# Altium project IMX93EVK-SOM.PrjPcb (part 3 of 6)

## Sheet C-08 eMMC.SchDoc
size 513 x 386 mm; Address1: 350W 9th Ave; Address2: Suite 206; Address3: Escondido CA 92025; Address4: United States; Revision: -; ENG_APP_DATE: --/--/--; DSN_APP_DATE: --/--/--; CHK_APP_DATE: --/--/--
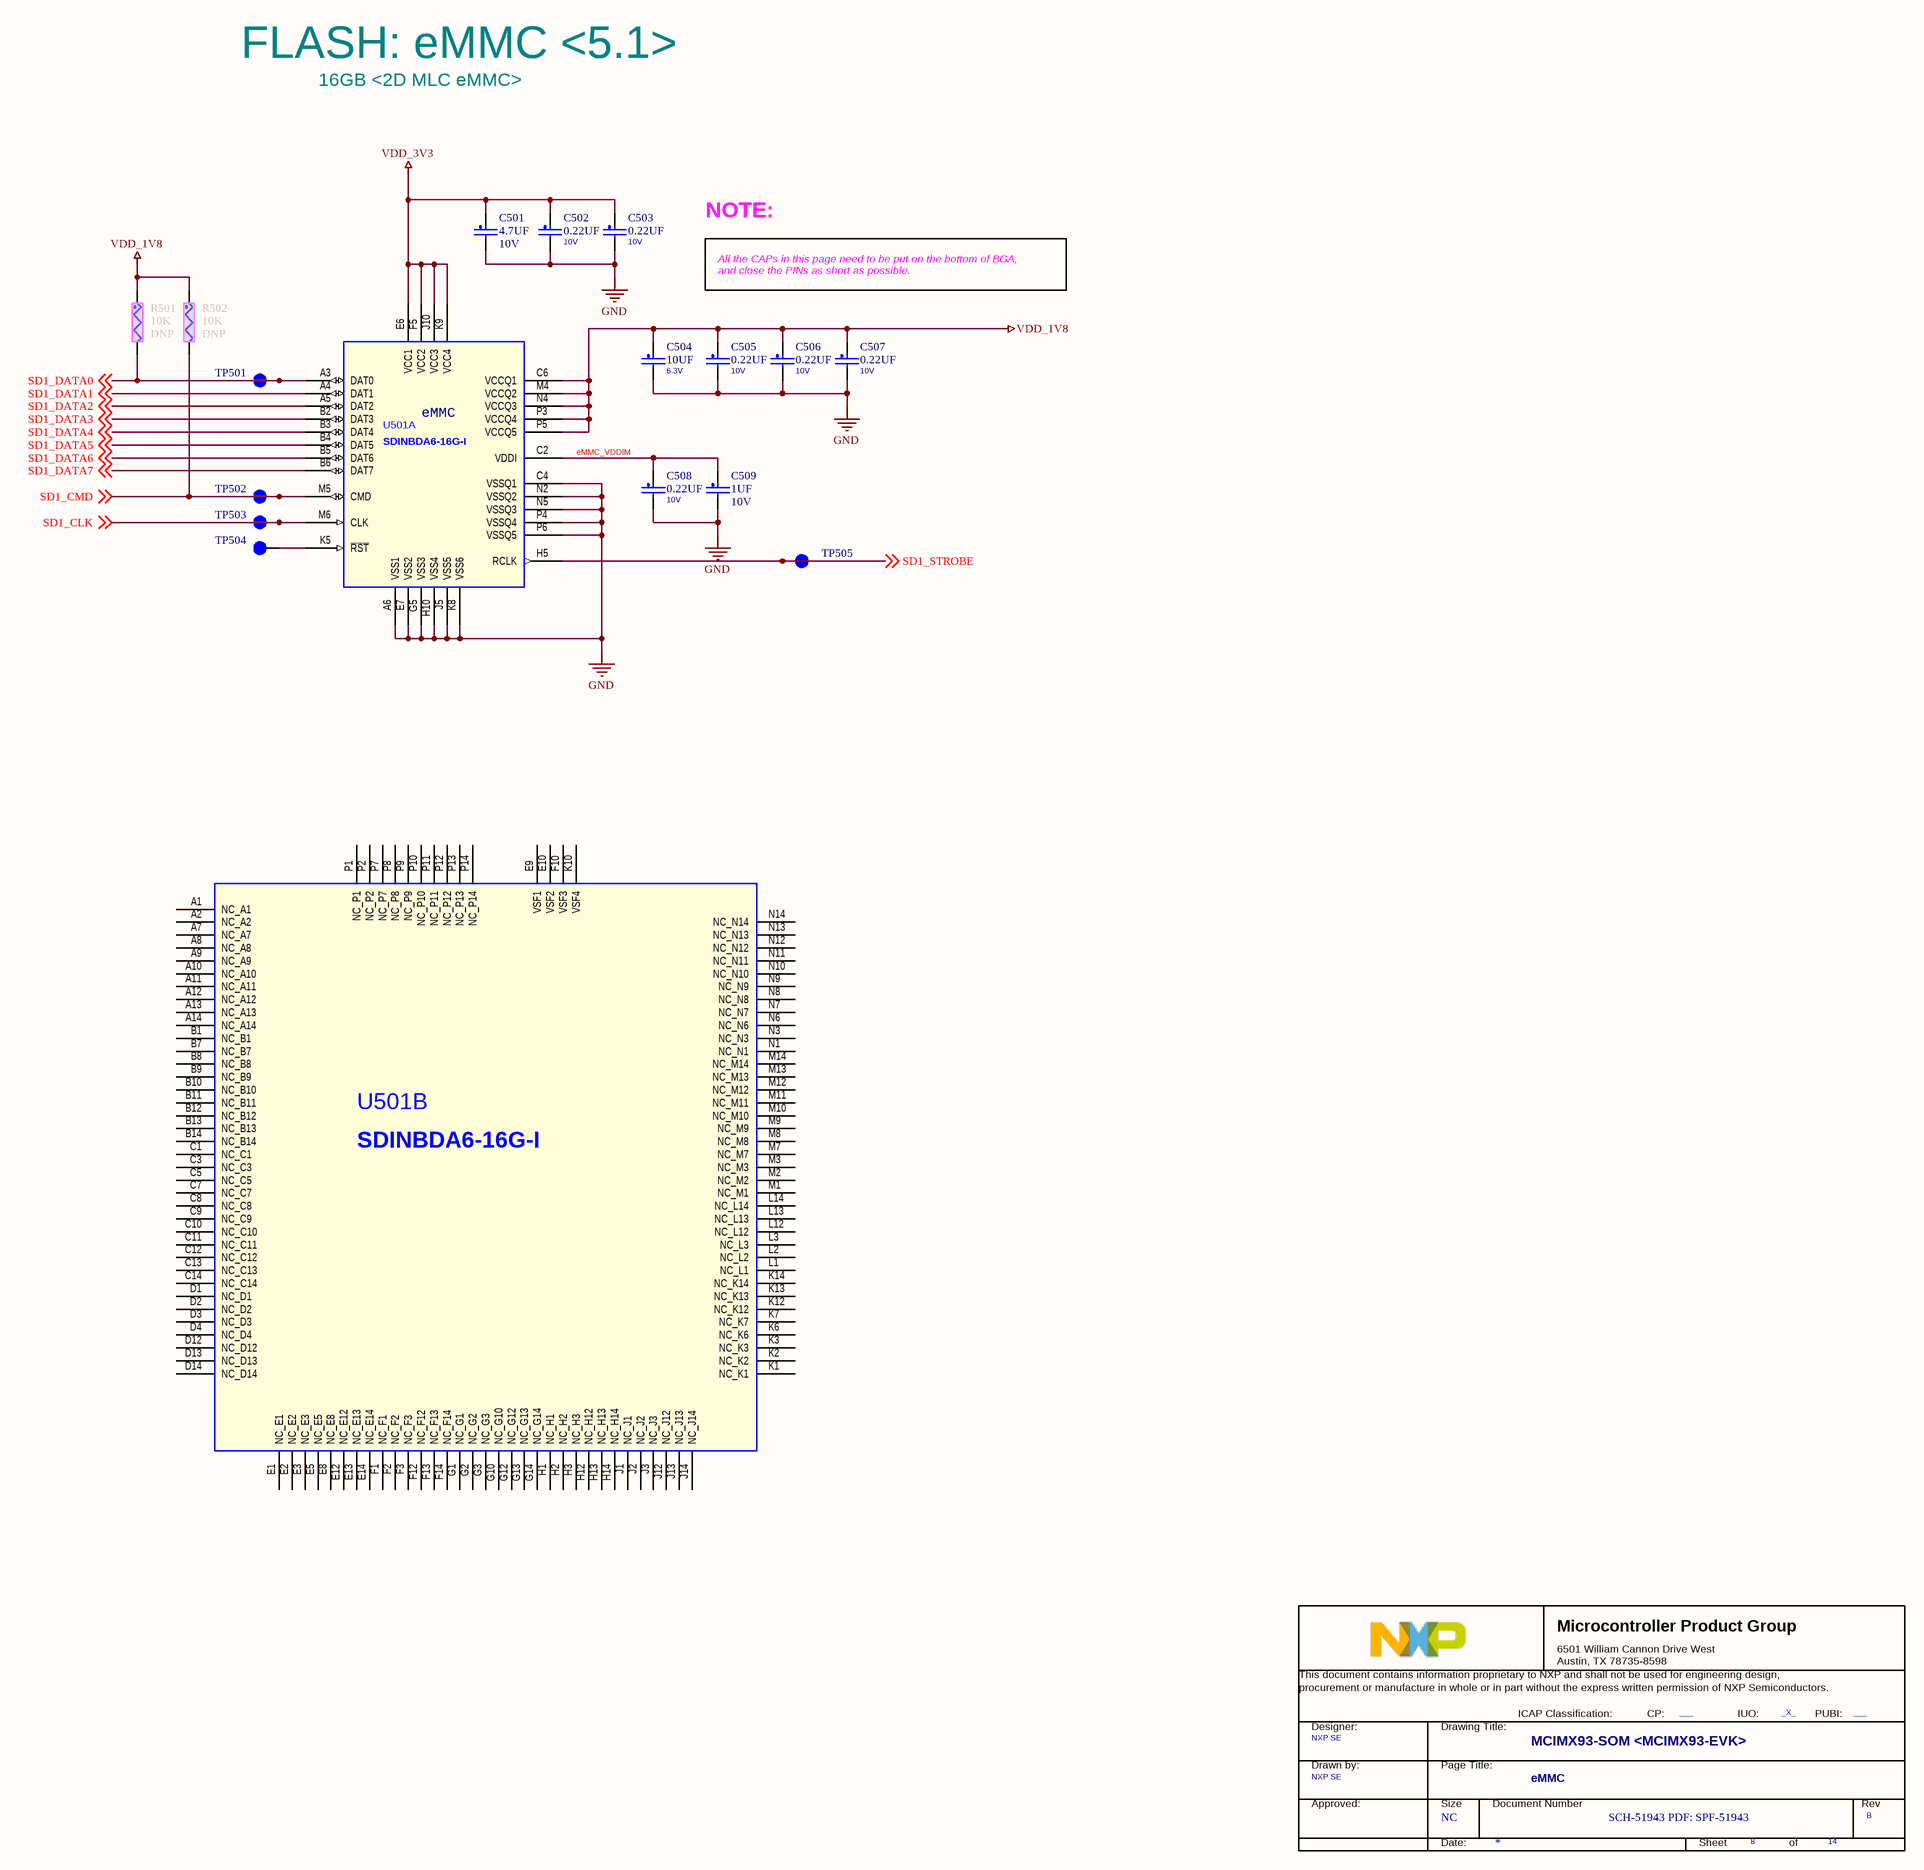
[diagram p16: C-08 eMMC.SchDoc]

### Parts
(Parts that share a designator on the sheet are numbered #1, #2 ... from top to bottom, then left to right.)
*#8  Doc: SCH-51943 PDF: SPF-51943  RevCode: B  Title: MCIMX93-SOM <MCIMX93-EVK>  Page Size: NC  Page Number: 8  Page Count: 14  PageTitle: eMMC  Designer: NXP SE  PUBI: ___  FIUO: _X_  (hidden comment: TitleBlock_MCPG)  (graphical)
C501  4.7UF  VOLTAGE: 10V  [cc0402_tol0p15]
C502  0.22UF  VOLTAGE: 10V  [0201_CC]
C503  0.22UF  VOLTAGE: 10V  [0201_CC]
C504  10UF  VOLTAGE: 6.3V  [0402_CC]
C505  0.22UF  VOLTAGE: 10V  [0201_CC]
C506  0.22UF  VOLTAGE: 10V  [0201_CC]
C507  0.22UF  VOLTAGE: 10V  [0201_CC]
C508  0.22UF  VOLTAGE: 10V  [0201_CC]
C509  1UF  VOLTAGE: 10V  [0201_CC]
R501  10K  ASSY_OPT: DNP  [0402_CC]
R502  10K  ASSY_OPT: DNP  [0402_CC]
TP501  tpad_020  [tpad_020]  (value not drawn)  (no BOM)
TP502  tpad_020  [tpad_020]  (value not drawn)  (no BOM)
TP503  tpad_020  [tpad_020]  (value not drawn)  (no BOM)
TP504  TPAD_015  [TPAD_015]  (value not drawn)  (no BOM)
TP505  tpad_020  [tpad_020]  (value not drawn)  (no BOM)
U501  SDINBDA6-16G-I  [fbga153_0p5_11p5x13]  (parts A,B of 2)

### Nets
GND: C501.2 C502.2 C503.2 C504.2 C505.2 C506.2 C507.2 C508.2 C509.2 U501.A6(VSS1) U501.C4(VSSQ1) U501.E7(VSS2) U501.G5(VSS3) U501.H10(VSS4) U501.J5(VSS5) U501.K8(VSS6) U501.N2(VSSQ2) U501.N5(VSSQ3) U501.P4(VSSQ4) U501.P6(VSSQ5)
VDD_1V8: C504.1 C505.1 C506.1 C507.1 R501.1 R502.1 U501.C6(VCCQ1) U501.M4(VCCQ2) U501.N4(VCCQ3) U501.P3(VCCQ4) U501.P5(VCCQ5)
VDD_3V3: C501.1 C502.1 C503.1 U501.E6(VCC1) U501.F5(VCC2) U501.J10(VCC3) U501.K9(VCC4)
eMMC_VDDIM: C508.1 C509.1 U501.C2(VDDI)
SD1_CLK: TP503.1(Pin1) U501.M6(CLK) ; off-sheet SD1_CLK
SD1_CMD: R502.2 TP502.1(Pin1) U501.M5(CMD) ; off-sheet SD1_CMD
SD1_DATA0: R501.2 TP501.1(Pin1) U501.A3(DAT0) ; off-sheet SD1_DATA0
SD1_DATA1: U501.A4(DAT1) ; off-sheet SD1_DATA1
SD1_DATA2: U501.A5(DAT2) ; off-sheet SD1_DATA2
SD1_DATA3: U501.B2(DAT3) ; off-sheet SD1_DATA3
SD1_DATA4: U501.B3(DAT4) ; off-sheet SD1_DATA4
SD1_DATA5: U501.B4(DAT5) ; off-sheet SD1_DATA5
SD1_DATA6: U501.B5(DAT6) ; off-sheet SD1_DATA6
SD1_DATA7: U501.B6(DAT7) ; off-sheet SD1_DATA7
SD1_STROBE: TP505.1(Pin1) U501.H5(RCLK) ; off-sheet SD1_STROBE
NetTP504_1: TP504.1(Pin1) U501.K5(~{RST})

Not connected (* = marked no-connect by the designer): U501 A1(NC_A1) A2(NC_A2) A7(NC_A7) A8(NC_A8) A9(NC_A9) A10(NC_A10) A11(NC_A11) A12(NC_A12) A13(NC_A13) A14(NC_A14) B1(NC_B1) B7(NC_B7) B8(NC_B8) B9(NC_B9) B10(NC_B10) B11(NC_B11) B12(NC_B12) B13(NC_B13) B14(NC_B14) C1(NC_C1) C3(NC_C3) C5(NC_C5) C7(NC_C7) C8(NC_C8) C9(NC_C9) C10(NC_C10) C11(NC_C11) C12(NC_C12) C13(NC_C13) C14(NC_C14) D1(NC_D1) D2(NC_D2) D3(NC_D3) D4(NC_D4) D12(NC_D12) D13(NC_D13) D14(NC_D14) E1(NC_E1) E2(NC_E2) E3(NC_E3) E5(NC_E5) E8(NC_E8) E9(VSF1) E10(VSF2) E12(NC_E12) E13(NC_E13) E14(NC_E14) F1(NC_F1) F2(NC_F2) F3(NC_F3) F10(VSF3) F12(NC_F12) F13(NC_F13) F14(NC_F14) G1(NC_G1) G2(NC_G2) G3(NC_G3) G10(NC_G10) G12(NC_G12) G13(NC_G13) G14(NC_G14) H1(NC_H1) H2(NC_H2) H3(NC_H3) H12(NC_H12) H13(NC_H13) H14(NC_H14) J1(NC_J1) J2(NC_J2) J3(NC_J3) J12(NC_J12) J13(NC_J13) J14(NC_J14) K1(NC_K1) K2(NC_K2) K3(NC_K3) K6(NC_K6) K7(NC_K7) K10(VSF4) K12(NC_K12) K13(NC_K13) K14(NC_K14) L1(NC_L1) L2(NC_L2) L3(NC_L3) L12(NC_L12) L13(NC_L13) L14(NC_L14) M1(NC_M1) M2(NC_M2) M3(NC_M3) M7(NC_M7) M8(NC_M8) M9(NC_M9) M10(NC_M10) M11(NC_M11) M12(NC_M12) M13(NC_M13) M14(NC_M14) N1(NC_N1) N3(NC_N3) N6(NC_N6) N7(NC_N7) N8(NC_N8) N9(NC_N9) N10(NC_N10) N11(NC_N11) N12(NC_N12) N13(NC_N13) N14(NC_N14) P1(NC_P1) P2(NC_P2) P7(NC_P7) P8(NC_P8) P9(NC_P9) P10(NC_P10) P11(NC_P11) P12(NC_P12) P13(NC_P13) P14(NC_P14)

### Notes on the sheet
- FLASH: eMMC <5.1>
- 16GB <2D MLC eMMC>
- NOTE:
- All the CAPs in this page need to be put on the bottom of BGA,
  and close the PINs as short as possible.
- 8
- 7
- 6
- 5
- 4
- 3
- 2
- 1
- REVISION
- DESCRIPTION
- DATE
- APPROVED
- F
- E
- D
- C
- B
- PROJECT:
- REV.
- ENG:
- APPROVALS
- PROJECT
- JordanDSP LLC <https://www.jordandsp.com>
- Envision Excellence
- SHT.
- A
- DSN:
- CHK:
- REFERENCE ITEMS
- PRJ VCS REVISION:
- TITLE
- DOC VCS REVISION:
- MODIFIED DATE:
- BOM:
- FAB DWG:
- FIRMWARE:
- ASSY DWG:
- SCALE:
- SIZE
- CAGE CODE
- FILE NAME
- DWG NO.
- PAGE
- PRODUCT REV
- OF
- (in symbol SDINBDA6_32G_I_VFBGA_153P, part A) eMMC
- (in symbol TitleBlock_MCPG) Microcontroller Product Group; 6501 William Cannon Drive West / Austin, TX 78735-8598; This document contains information proprietary to NXP and shall not be used for engineering design,; procurement or manufacture in whole or in part without the express written permission of NXP Semiconductors.; ICAP Classification:; CP:; IUO:; PUBI:; Designer:; Drawing Title:; Drawn by:; Page Title:; Approved:; Size; Document Number; Rev; Date:; Sheet; of

### Library data of the parts
*#8 = TitleBlock_MCPG: OrgName: NXP Semiconductor; OrgAddr1: NO. 192 Liangjing Rd. Pudong New Area, ShangHai; Page Create Date: March  8, 1995; DrawnBy: NXP SE; FCP: ___; Page Modify Date: *
C501 = CAP_NP: CAP CER 4.7uF 10V 10% X5R 0402; CLASS: DISCRETE; AGILE_PN: 150-80044; MFG_NAME01: SAMSUNG ELECTRO MECHANICS; MFG_PN01: CL05A475KP5NRNC; CAD_APPROVED: Yes; FPLIST: cc0402_tol0p15,cc0402_tol0p15_ov,0402_cc_nsp; 3D_Mechanical_Footprint_File: cc0402_tol0p15; PCB Footprint: cc0402_tol0p15; Tolerance: 10%; ROHS: Yes; HEIGHT: 0.65MM
C502 C507 C508 = CAP_NP: CAP CER 0.22UF 10V 20% X5R 0201; CLASS: DISCRETE; AGILE_PN: 150-78815; MFG_NAME01: Taiyo Yuden; MFG_PN01: LMK063BJ224MP-F; CAD_APPROVED: Yes; FPLIST: CC0201,CC0201_HD,0201_CC; PCB Footprint: 0201_CC; Tolerance: 20%; ROHS: Yes; HEIGHT: 0.33MM
C503 C505 C506 = CAP_NP: CAP CER 0.22UF 10V 20% X5R 0201; CLASS: DISCRETE; FPLIST: CC0201,CC0201_HD,0201_CC; CAD_APPROVED: Yes; MFG_PN01: LMK063BJ224MP-F; MFG_NAME01: Taiyo Yuden; AGILE_PN: 150-78815; PCB Footprint: 0201_CC; HEIGHT: 0.33MM; ROHS: Yes; Tolerance: 20%
C504 = CAP_NP: CAP CER 10UF 6.3V 20% X5R 0402; CLASS: DISCRETE; FPLIST: CC0402_25,CC0402_HD,0402_CC; CAD_APPROVED: Yes; MFG_PN01: CL05A106MQ5NUNC; MFG_NAME01: SAMSUNG ELECTRO MECHANICS; AGILE_PN: 150-79163; PCB Footprint: 0402_CC; HEIGHT: 0.65 MM; ROHS: Yes; Tolerance: 20%
C509 = CAP_NP: CAP CER 1.0uF 10V 10% X5R 0201; CLASS: DISCRETE; AGILE_PN: 150-81088; MFG_NAME01: SAMSUNG ELECTRO MECHANICS; MFG_PN01: CL03A105KP3NSNC; CAD_APPROVED: Yes; FPLIST: CC0201,CC0201_HD,0201_CC,cc_0201_cir; Temp Range: -55¡ãC to 85¡ãC; PCB Footprint: 0201_CC; Package Type: SMD/SMT; Package Size: 0201 (0603 Metric); Tolerance: 10%; ROHS: Yes; HEIGHT: 0.35MM
R501 = RES: RES MF 10K 1/16W 5% 0402; CLASS: DISCRETE; AGILE_PN: 470-75557; MFG_NAME01: VISHAY INTERTECHNOLOGY; MFG_PN01: CRCW040210K0JNED; CAD_APPROVED: Yes; FPLIST: RC0402_25,RC0402_HD,0402_CC; Tolerance: 5%; ROHS: Yes; HEIGHT: 0.4 MM; PCB Footprint: 0402_CC
R502 = RES: RES MF 10K 1/16W 5% 0402; CLASS: DISCRETE; FPLIST: RC0402_25,RC0402_HD,0402_CC; CAD_APPROVED: Yes; MFG_PN01: CRCW040210K0JNED; MFG_NAME01: VISHAY INTERTECHNOLOGY; AGILE_PN: 470-75557; HEIGHT: 0.4 MM; ROHS: Yes; Tolerance: 5%; PCB Footprint: 0402_CC
TP501 = TESTLOOP: TEST POINT PAD 0.5MM DIA SMT, NO PART TO ORDER; ASSY_OPT: DNP; CLASS: IO; CAD_APPROVED: Yes; AGILE_PN: 211-77484; PCB Footprint: tpad_020; HEIGHT: 0.1MM; ROHS: Yes
TP502 TP503 TP505 = TESTLOOP: TEST POINT PAD 0.5MM DIA SMT, NO PART TO ORDER; ASSY_OPT: DNP; CLASS: IO; AGILE_PN: 211-77484; CAD_APPROVED: Yes; PCB Footprint: tpad_020; ROHS: Yes; HEIGHT: 0.1MM
TP504 = TESTLOOP: TEST POINT PAD 15MIL DIA SMT, NO PART TO ORDER; ASSY_OPT: DNP; CLASS: IO; CAD_APPROVED: Yes; MFG_PN01: NOTACOMPONENT; AGILE_PN: 211-76645; PCB Footprint: TPAD_015; HEIGHT: 0.1MM; ROHS: Yes; MFG_NAME01: NOTACOMPONENT
U501 = SDINBDA6_32G_I_VFBGA_153P: IC MEM NAND FLASH 16GB MMC 5.1 CTLR 2.7-3.6V FBGA153; MFG_NAME01: SANDISK CORPORATION; Temp Range: -25¡ãC to 85¡ãC; CAD_APPROVED: Yes; AGILE_PN: 342-00870; CLASS: IC; PCB Footprint: fbga153_0p5_11p5x13; MFG_PN01: SDINBDA6-16G-I; ROHS: Yes; HEIGHT: 1MM

## Sheet C-09 BOOT_CFG.SchDoc
size 513 x 386 mm; Address1: 350W 9th Ave; Address2: Suite 206; Address3: Escondido CA 92025; Address4: United States; Revision: -; ENG_APP_DATE: --/--/--; DSN_APP_DATE: --/--/--; CHK_APP_DATE: --/--/--
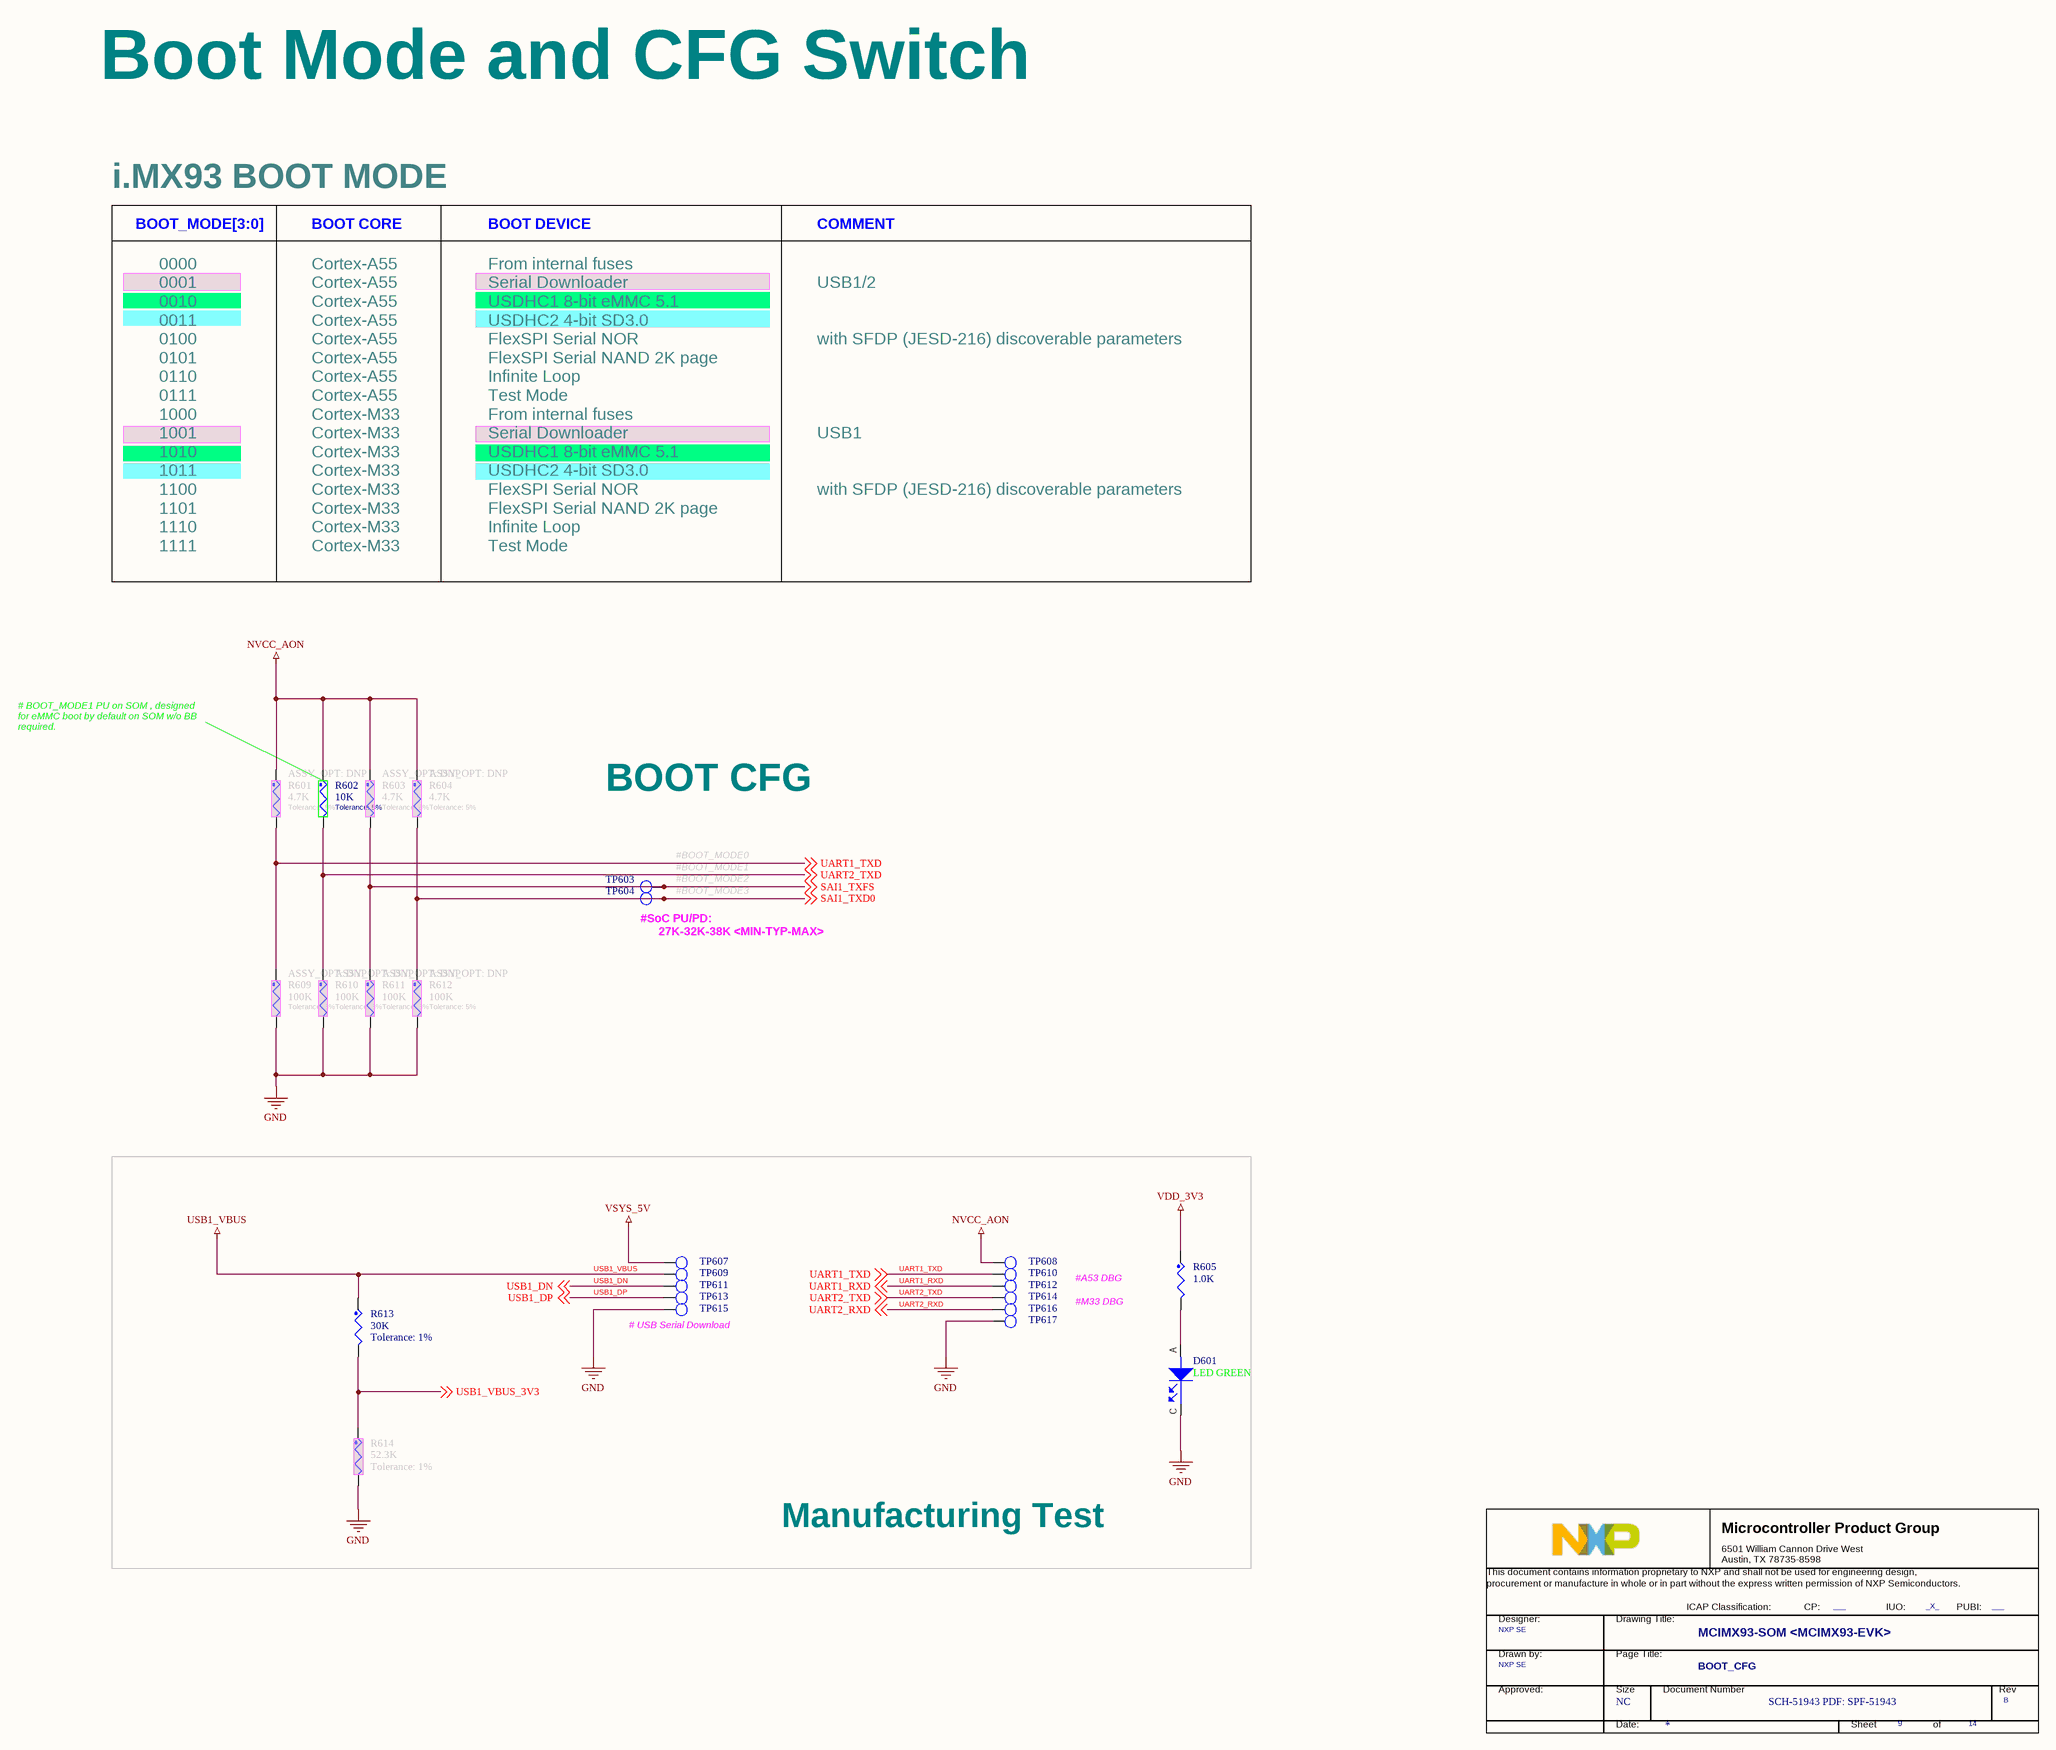
[diagram p17: C-09 BOOT_CFG.SchDoc]

### Parts
(Parts that share a designator on the sheet are numbered #1, #2 ... from top to bottom, then left to right.)
*#9  Doc: SCH-51943 PDF: SPF-51943  RevCode: B  Title: MCIMX93-SOM <MCIMX93-EVK>  Page Size: NC  Page Number: 9  Page Count: 14  PageTitle: BOOT_CFG  Designer: NXP SE  PUBI: ___  FIUO: _X_  (hidden comment: TitleBlock_MCPG)  (graphical)
D601  LED GREEN  [LED_0603]
R601  4.7K  ASSY_OPT: DNP  Tolerance: 5%  [0402_CC]
R602  10K  Tolerance: 5%  [0402_CC]
R603  4.7K  ASSY_OPT: DNP  Tolerance: 5%  [0402_CC]
R604  4.7K  ASSY_OPT: DNP  Tolerance: 5%  [0402_CC]
R605  1.0K  [0402_CC]
R609  100K  ASSY_OPT: DNP  Tolerance: 5%  [0402_CC]
R610  100K  ASSY_OPT: DNP  Tolerance: 5%  [0402_CC]
R611  100K  ASSY_OPT: DNP  Tolerance: 5%  [0402_CC]
R612  100K  ASSY_OPT: DNP  Tolerance: 5%  [0402_CC]
R613  30K  Tolerance: 1%  [0402_CC]
R614  52.3K  Tolerance: 1%  [0201_CC]
TP603  TP_35MIL  [testpoint_35mil]  (value not drawn)  (no BOM)
TP604  TP_35MIL  [testpoint_35mil]  (value not drawn)  (no BOM)
TP607  TP_35MIL  [testpoint_35mil]  (value not drawn)  (no BOM)
TP608  TP_35MIL  [testpoint_35mil]  (value not drawn)  (no BOM)
TP609  TP_35MIL  [testpoint_35mil]  (value not drawn)  (no BOM)
TP610  TP_35MIL  [testpoint_35mil]  (value not drawn)  (no BOM)
TP611  TP_35MIL  [testpoint_35mil]  (value not drawn)  (no BOM)
TP612  TP_35MIL  [testpoint_35mil]  (value not drawn)  (no BOM)
TP613  TP_35MIL  [testpoint_35mil]  (value not drawn)  (no BOM)
TP614  TP_35MIL  [testpoint_35mil]  (value not drawn)  (no BOM)
TP615  TP_35MIL  [testpoint_35mil]  (value not drawn)  (no BOM)
TP616  TP_35MIL  [testpoint_35mil]  (value not drawn)  (no BOM)
TP617  TP_35MIL  [testpoint_35mil]  (value not drawn)  (no BOM)

### Blocks framed on the sheet
Manufacturing Test: D601 R605 R613 R614 TP607-TP617

### Nets
GND: D601.C(CATHODE) R609.2 R610.2 R611.2 R612.2 R614.2 TP615.1(TP) TP617.1(TP)
NVCC_AON: R601.1 R602.1 R603.1 R604.1 TP608.1(TP)
USB1_VBUS: R613.1 TP609.1(TP)
VDD_3V3: R605.1
VSYS_5V: TP607.1(TP)
SAI1_TXD0: R604.2 R612.1 TP604.1(TP) ; off-sheet SAI1_TXD0
SAI1_TXFS: R603.2 R611.1 TP603.1(TP) ; off-sheet SAI1_TXFS
UART1_RXD: TP612.1(TP) ; off-sheet UART1_RXD
UART1_TXD: R601.2 R609.1 TP610.1(TP) ; off-sheet UART1_TXD
UART2_RXD: TP616.1(TP) ; off-sheet UART2_RXD
UART2_TXD: R602.2 R610.1 TP614.1(TP) ; off-sheet UART2_TXD
USB1_DN: TP611.1(TP) ; off-sheet USB1_DN
USB1_DP: TP613.1(TP) ; off-sheet USB1_DP
USB1_VBUS_3V3: R613.2 R614.1 ; off-sheet USB1_VBUS_3V3
NetD601_A: D601.A(ANODE) R605.2

### Notes on the sheet
- Boot Mode and CFG Switch
- i.MX93 BOOT MODE
- BOOT_MODE[3:0]
- BOOT CORE
- BOOT DEVICE
- COMMENT
- 0000
  0001
  0010
  0011
  0100
  0101
  0110
  0111
  1000
  1001
  1010
  1011
  1100
  1101
  1110
  1111
- Cortex-A55
  Cortex-A55
  Cortex-A55
  Cortex-A55
  Cortex-A55
  Cortex-A55
  Cortex-A55
  Cortex-A55
  Cortex-M33
  Cortex-M33
  Cortex-M33
  Cortex-M33
  Cortex-M33
  Cortex-M33
  Cortex-M33
  Cortex-M33
- From internal fuses
  Serial Downloader
  USDHC1 8-bit eMMC 5.1
  USDHC2 4-bit SD3.0
  FlexSPI Serial NOR
  FlexSPI Serial NAND 2K page
  Infinite Loop
  Test Mode
  From internal fuses
  Serial Downloader
  USDHC1 8-bit eMMC 5.1
  USDHC2 4-bit SD3.0
  FlexSPI Serial NOR
  FlexSPI Serial NAND 2K page
  Infinite Loop
  Test Mode
- USB1/2
  with SFDP (JESD-216) discoverable parameters
  USB1
  with SFDP (JESD-216) discoverable parameters
- # BOOT_MODE1 PU on SOM , designed
  for eMMC boot by default on SOM w/o BB
  required.
- BOOT CFG
- #BOOT_MODE0
- #BOOT_MODE1
- #BOOT_MODE2
- #BOOT_MODE3
- (near TP604) #SoC PU/PD:
  27K-32K-38K <MIN-TYP-MAX>
- #A53 DBG
- (near TP615) # USB Serial Download
- #M33 DBG
- 8
- 7
- 6
- 5
- 4
- 3
- 2
- 1
- REVISION
- DESCRIPTION
- DATE
- APPROVED
- F
- E
- D
- C
- B
- PROJECT:
- REV.
- ENG:
- APPROVALS
- PROJECT
- JordanDSP LLC <https://www.jordandsp.com>
- Envision Excellence
- SHT.
- A
- DSN:
- CHK:
- REFERENCE ITEMS
- PRJ VCS REVISION:
- TITLE
- DOC VCS REVISION:
- MODIFIED DATE:
- BOM:
- FAB DWG:
- FIRMWARE:
- ASSY DWG:
- SCALE:
- SIZE
- CAGE CODE
- FILE NAME
- DWG NO.
- PAGE
- PRODUCT REV
- OF
- (in symbol TitleBlock_MCPG) Microcontroller Product Group; 6501 William Cannon Drive West / Austin, TX 78735-8598; This document contains information proprietary to NXP and shall not be used for engineering design,; procurement or manufacture in whole or in part without the express written permission of NXP Semiconductors.; ICAP Classification:; CP:; IUO:; PUBI:; Designer:; Drawing Title:; Drawn by:; Page Title:; Approved:; Size; Document Number; Rev; Date:; Sheet; of

### Library data of the parts
*#9 = TitleBlock_MCPG: OrgAddr1: NO. 192 Liangjing Rd. Pudong New Area, ShangHai; OrgName: NXP Semiconductor; Page Create Date: March  8, 1995; DrawnBy: NXP SE; FCP: ___; Page Modify Date: *
D601 = LED: LED GRN SGL 25MA SMT 0603; CLASS: IC; CAD_APPROVED: Yes; MFG_PN01: 598-8070-107F; MFG_NAME01: DIALIGHT; AGILE_PN: 370-76672; VOLTAGE: 2V; HEIGHT: 0.8 MM; ROHS: Yes; PCB Footprint: LED_0603
R601 = RES: RES MF 4.7K 1/10W 5% AEC-Q200 0402; CLASS: DISCRETE; MFG_PN01: RK73B1ETTP472J; MFG_NAME01: KOA SPEER; CAD_APPROVED: Yes; FPLIST: RC0402_25,RC0402_HD,0402_CC,RC0402_X2; AGILE_PN: 470-82064; VOLTAGE: 50V; Temp Range: -55C to +155C; PCB Footprint: 0402_CC; ROHS: Yes; HEIGHT: 0.41mm
R602 = RES: as R501 on sheet C-08 eMMC; PCB Footprint: 0402_CC; ROHS: Yes; HEIGHT: 0.4 MM
R603 R604 = RES: RES MF 4.7K 1/10W 5% AEC-Q200 0402; CLASS: DISCRETE; Temp Range: -55C to +155C; VOLTAGE: 50V; AGILE_PN: 470-82064; FPLIST: RC0402_25,RC0402_HD,0402_CC,RC0402_X2; CAD_APPROVED: Yes; MFG_NAME01: KOA SPEER; MFG_PN01: RK73B1ETTP472J; PCB Footprint: 0402_CC; HEIGHT: 0.41mm; ROHS: Yes
R605 = RES: RES MF 1.0K 1/16W 1% 0402; CLASS: DISCRETE; MFG_PN01: RC0402FR-071KL; MFG_NAME01: YAGEO AMERICA; CAD_APPROVED: Yes; FPLIST: RC0402_25,RC0402_HD,RC0402_X2,0402_CC; AGILE_PN: 470-76037; PCB Footprint: 0402_CC; VOLTAGE: 1/16W; ROHS: Yes; Tolerance: 1%; HEIGHT: 0.4MM
R609 R612 = RES: RES MF 100K 1/16W 5% 0402; CLASS: DISCRETE; MFG_PN01: CR0402-16W-104JT; MFG_NAME01: VENKEL COMPANY; Temp Range: -55C to +155C; CAD_APPROVED: Yes; FPLIST: RC0402_25,RC0402_HD,0402_CC; AGILE_PN: 470-75597; VOLTAGE: 50V; PCB Footprint: 0402_CC; ROHS: Yes; HEIGHT: 0.40 MM
R610 R611 = RES: RES MF 100K 1/16W 5% 0402; CLASS: DISCRETE; AGILE_PN: 470-75597; FPLIST: RC0402_25,RC0402_HD,0402_CC; CAD_APPROVED: Yes; Temp Range: -55C to +155C; MFG_NAME01: VENKEL COMPANY; MFG_PN01: CR0402-16W-104JT; VOLTAGE: 50V; PCB Footprint: 0402_CC; HEIGHT: 0.40 MM; ROHS: Yes
R613 = RES: RES MF 30K 1/10W 1% AEC-Q200 0402; CLASS: DISCRETE; MFG_PN01: RK73H1ETTP3002F; MFG_NAME01: KOA SPEER; Temp Range: -55C to +155C; VOLTAGE: 50V; CAD_APPROVED: Yes; FPLIST: RC0402_25,RC0402_HD,0402_CC; AGILE_PN: 470-81708; PCB Footprint: 0402_CC; ROHS: Yes; HEIGHT: 0.40 MM
R614 = RES: RES MF 52.3K OHM 1% 1/20W 0201; CLASS: DISCRETE; MFG_PN01: RC0201FR-0752K3L; MFG_NAME01: YAGEO AMERICA; Temp Range: -55&#8451; to 125&#8451;; CAD_APPROVED: Yes; FPLIST: RC0201,0201_CC; AGILE_PN: 470-81464; ROHS: Yes; HEIGHT: 0.26MM; PCB Footprint: 0201_CC
TP603 TP607 TP614 TP616 TP617 = T POINT R: TEST POINT PAD .035 SMT, no part to order; ASSY_OPT: DNP; CLASS: IC; CAD_APPROVED: Yes; AGILE_PN: 510-75618; PCB Footprint: testpoint_35mil; HEIGHT: 0.1MM; ROHS: Yes
TP604 TP608-TP613 TP615 = T POINT R: TEST POINT PAD .035 SMT, no part to order; ASSY_OPT: DNP; CLASS: IC; AGILE_PN: 510-75618; CAD_APPROVED: Yes; PCB Footprint: testpoint_35mil; ROHS: Yes; HEIGHT: 0.1MM

## Sheet C-10 PMIC.SchDoc
size 513 x 386 mm; Address1: 350W 9th Ave; Address2: Suite 206; Address3: Escondido CA 92025; Address4: United States; Revision: -; ENG_APP_DATE: --/--/--; DSN_APP_DATE: --/--/--; CHK_APP_DATE: --/--/--
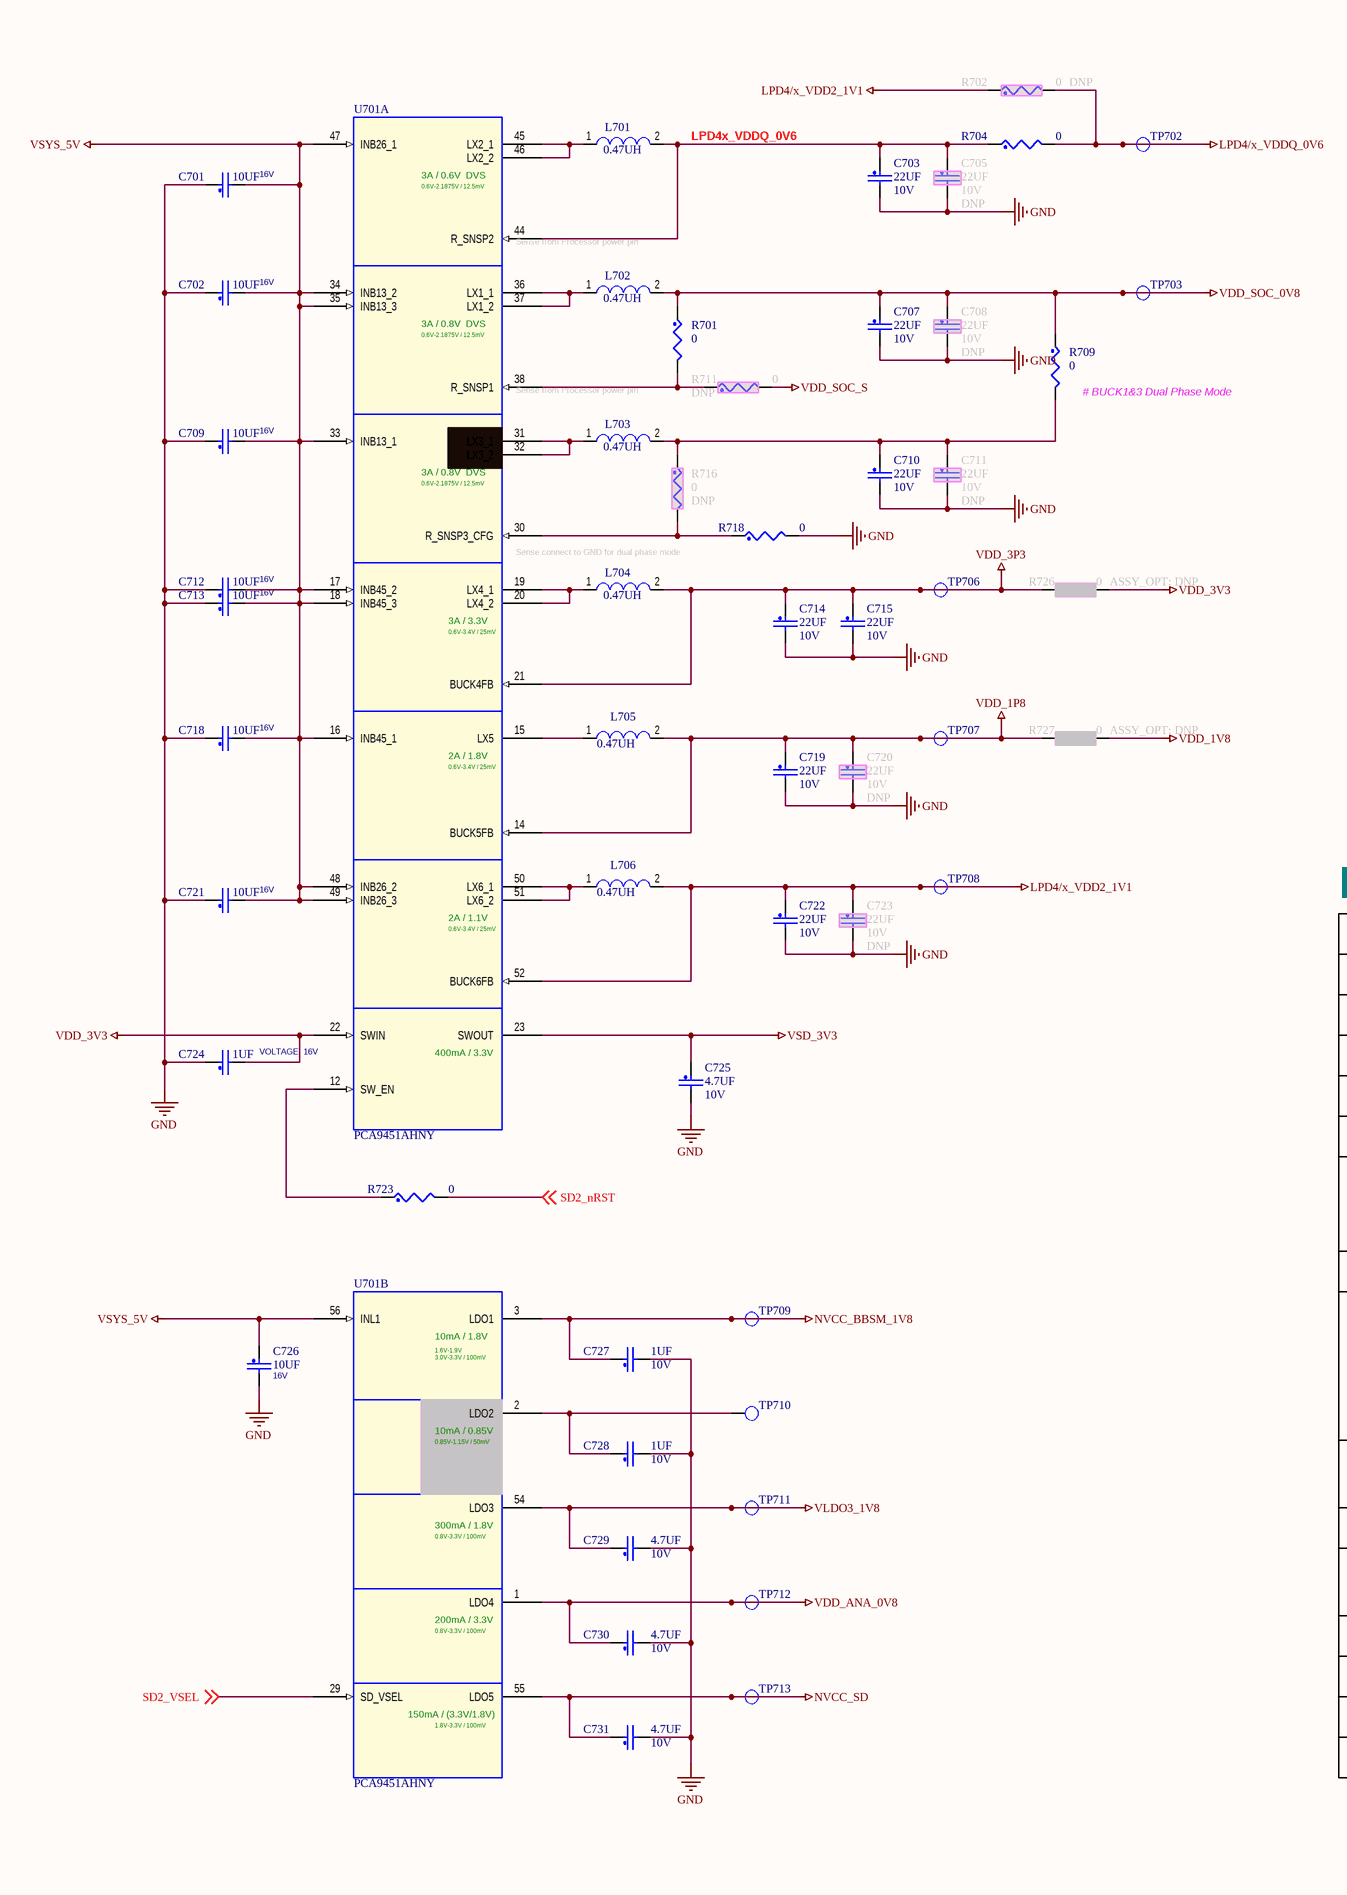
[diagram p18: C-10 PMIC.SchDoc, left]
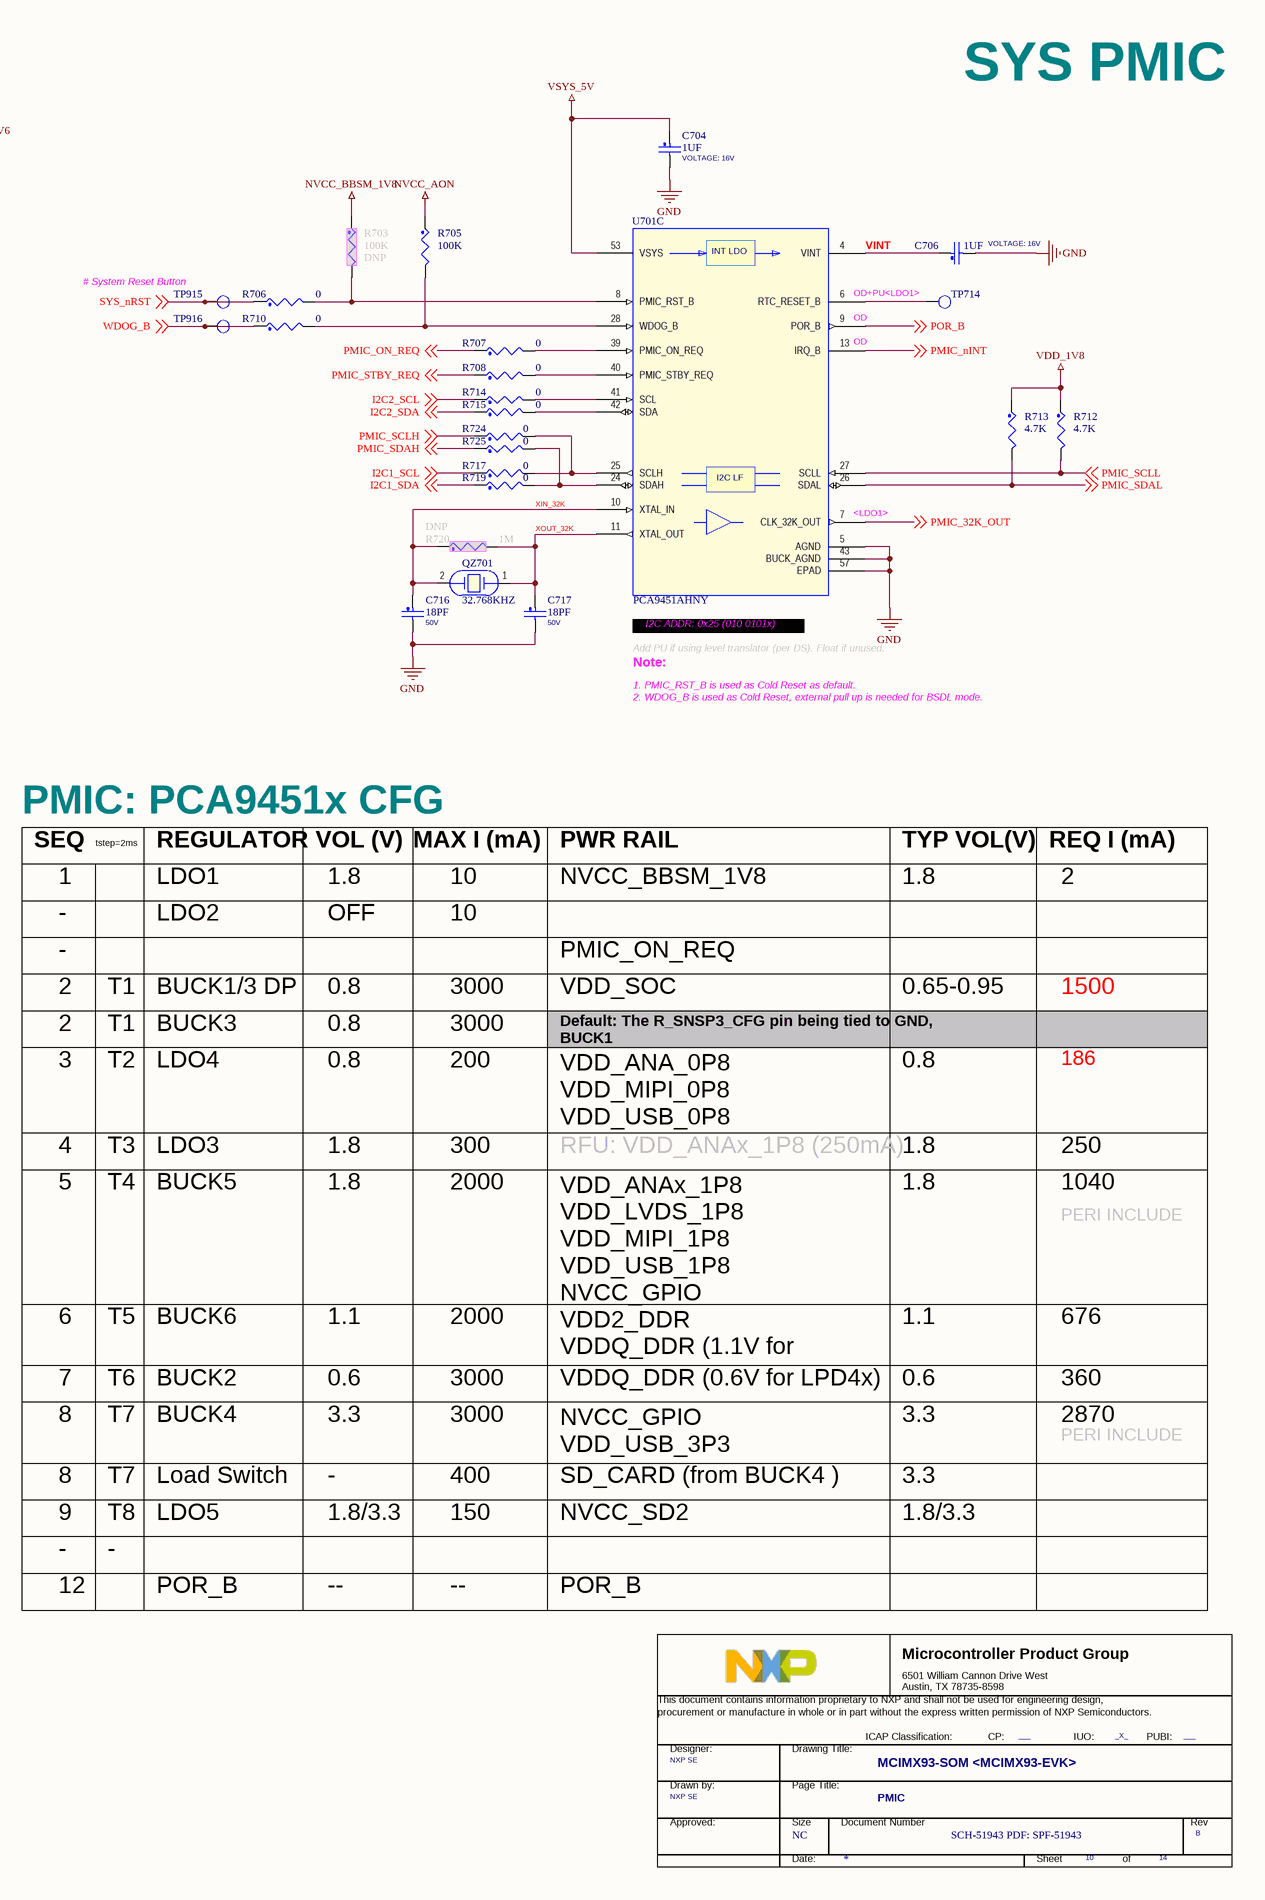
[diagram p19: C-10 PMIC.SchDoc, right]

### Parts
(Parts that share a designator on the sheet are numbered #1, #2 ... from top to bottom, then left to right.)
*#10  Doc: SCH-51943 PDF: SPF-51943  RevCode: B  Title: MCIMX93-SOM <MCIMX93-EVK>  Page Size: NC  Page Number: 10  Page Count: 14  PageTitle: PMIC  Designer: NXP SE  PUBI: ___  FIUO: _X_  (hidden comment: TitleBlock_MCPG)  (graphical)
C701  10UF  VOLTAGE: 16V  [CC0603]
C702  10UF  VOLTAGE: 16V  [CC0603]
C703  22UF  VOLTAGE: 10V  [CC0603]
C704  1UF  VOLTAGE: 16V  [0402_CC]
C705  22UF  ASSY_OPT: DNP  VOLTAGE: 10V  [CC0603]
C706  1UF  VOLTAGE: 16V  [0402_CC]
C707  22UF  VOLTAGE: 10V  [CC0603]
C708  22UF  ASSY_OPT: DNP  VOLTAGE: 10V  [CC0603]
C709  10UF  VOLTAGE: 16V  [CC0603]
C710  22UF  VOLTAGE: 10V  [CC0603]
C711  22UF  ASSY_OPT: DNP  VOLTAGE: 10V  [CC0603]
C712  10UF  VOLTAGE: 16V  [CC0603]
C713  10UF  VOLTAGE: 16V  [CC0603]
C714  22UF  VOLTAGE: 10V  [CC0603]
C715  22UF  VOLTAGE: 10V  [CC0603]
C716  18PF  VOLTAGE: 50V  [0201_CC]
C717  18PF  VOLTAGE: 50V  [0201_CC]
C718  10UF  VOLTAGE: 16V  [CC0603]
C719  22UF  VOLTAGE: 10V  [CC0603]
C720  22UF  ASSY_OPT: DNP  VOLTAGE: 10V  [CC0603]
C721  10UF  VOLTAGE: 16V  [CC0603]
C722  22UF  VOLTAGE: 10V  [CC0603]
C723  22UF  ASSY_OPT: DNP  VOLTAGE: 10V  [CC0603]
C724  1UF  VOLTAGE: 16V  [0402_CC]
C725  4.7UF  VOLTAGE: 10V  [cc0402_tol0p15]
C726  10UF  VOLTAGE: 16V  [CC0603]
C727  1UF  VOLTAGE: 10V  [0201_CC]
C728  1UF  VOLTAGE: 10V  [0201_CC]
C729  4.7UF  VOLTAGE: 10V  [cc0402_tol0p15]
C730  4.7UF  VOLTAGE: 10V  [cc0402_tol0p15]
C731  4.7UF  VOLTAGE: 10V  [cc0402_tol0p15]
L701  0.47UH  [ind_sph2520]
L702  0.47UH  [ind_sph2520]
L703  0.47UH  [ind_sph2520]
L704  0.47UH  [ind_sph2520]
L705  0.47UH  [IND_2016A]
L706  0.47UH  [IND_2016A]
QZ701  32.768KHZ  [XTAL2-3P2X1P5-SM]
R701  0  [0402_CC]
R702  0  ASSY_OPT: DNP  [0603_CC]
R703  100K  ASSY_OPT: DNP  [0402_CC]
R704  0  [0603_CC]
R705  100K  [0402_CC]
R706  0  [0402_CC]
R707  0  [0402_CC]
R708  0  [0402_CC]
R709  0  [0603_CC]
R710  0  [0402_CC]
R711  0  ASSY_OPT: DNP  [0402_CC]
R712  4.7K  [0402_CC]
R713  4.7K  [0402_CC]
R714  0  [0402_CC]
R715  0  [0402_CC]
R716  0  ASSY_OPT: DNP  [0402_CC]
R717  0  [0201_CC]
R718  0  [0402_CC]
R719  0  [0201_CC]
R720  1M  ASSY_OPT: DNP  [0201_CC]
R723  0  [0402_CC]
R724  0  [0201_CC]
R725  0  [0201_CC]
R726  0  ASSY_OPT: DNP  [RC0805_OV]
R727  0  ASSY_OPT: DNP  [RC0805_OV]
TP702  TP_35MIL  [testpoint_35mil]  (value not drawn)  (no BOM)
TP703  TP_35MIL  [testpoint_35mil]  (value not drawn)  (no BOM)
TP706  TP_35MIL  [testpoint_35mil]  (value not drawn)  (no BOM)
TP707  TP_35MIL  [testpoint_35mil]  (value not drawn)  (no BOM)
TP708  TP_35MIL  [testpoint_35mil]  (value not drawn)  (no BOM)
TP709  TP_35MIL  [testpoint_35mil]  (value not drawn)  (no BOM)
TP710  TP_35MIL  [testpoint_35mil]  (value not drawn)  (no BOM)
TP711  TP_35MIL  [testpoint_35mil]  (value not drawn)  (no BOM)
TP712  TP_35MIL  [testpoint_35mil]  (value not drawn)  (no BOM)
TP713  TP_35MIL  [testpoint_35mil]  (value not drawn)  (no BOM)
TP714  TP_35MIL  [testpoint_35mil]  (value not drawn)  (no BOM)
TP915  TP_35MIL  [testpoint_35mil]  (value not drawn)  (no BOM)
TP916  TP_35MIL  [testpoint_35mil]  (value not drawn)  (no BOM)
U701  PCA9451AHNY  [hvqfn56_0p4_7x7_ep4p7mm]  (parts A,B,C of 3)

### Nets
GND: C701.1 C702.1 C703.2 C704.2 C705.2 C706.2 C707.2 C708.2 C709.1 C710.2 C711.2 C712.1 C713.1 C714.2 C715.2 C716.2 C717.2 C718.1 C719.2 C720.2 C721.1 C722.2 C723.2 C724.1 C725.2 C726.2 C727.2 C728.2 C729.2 C730.2 C731.2 R718.2 U701.5(AGND) U701.43(BUCK_AGND) U701.57(EPAD)
LPD4/x_VDD2_1V1: C722.1 C723.1 L706.2 R702.1 TP708.1(TP) U701.52(BUCK6FB)
LPD4/x_VDDQ_0V6: R702.2 R704.2 TP702.1(TP)
NVCC_AON: R705.1
NVCC_BBSM_1V8: C727.1 R703.1 TP709.1(TP) U701.3(LDO1)
NVCC_SD: C731.1 TP713.1(TP) U701.55(LDO5)
VDD_1P8: C719.1 C720.1 L705.2 R727.1 TP707.1(TP) U701.14(BUCK5FB)
VDD_1V8: R712.1 R713.1 R727.2
VDD_3P3: C714.1 C715.1 L704.2 R726.1 TP706.1(TP) U701.21(BUCK4FB)
VDD_3V3: C724.2 R726.2 U701.22(SWIN)
VDD_ANA_0V8: C730.1 TP712.1(TP) U701.1(LDO4)
VDD_SOC_0V8: C707.1 C708.1 L702.2 R701.1 R709.1 TP703.1(TP)
VDD_SOC_S: R711.2  [project net VDD_SOC]
VLDO3_1V8: C729.1 TP711.1(TP) U701.54(LDO3)
VSD_3V3: C725.1 U701.23(SWOUT)
VSYS_5V: C701.2 C702.2 C704.1 C709.2 C712.2 C713.2 C718.2 C721.2 C726.1 U701.16(INB45_1) U701.17(INB45_2) U701.18(INB45_3) U701.33(INB13_1) U701.34(INB13_2) U701.35(INB13_3) U701.47(INB26_1) U701.48(INB26_2) U701.49(INB26_3) U701.53(VSYS) U701.56(INL1)
I2C1_SCL: R717.1 ; off-sheet I2C1_SCL
I2C1_SDA: R719.1 ; off-sheet I2C1_SDA
I2C2_SCL: R714.1 ; off-sheet I2C2_SCL
I2C2_SDA: R715.1 ; off-sheet I2C2_SDA
LPD4x_VDDQ_0V6: C703.1 C705.1 L701.2 R704.1 U701.44(R_SNSP2)
PMIC_32K_OUT: U701.7(CLK_32K_OUT) ; off-sheet PMIC_32K_OUT
PMIC_nINT: U701.13(IRQ_B) ; off-sheet PMIC_nINT
PMIC_ON_REQ: R707.1 ; off-sheet PMIC_ON_REQ
PMIC_SCLH: R724.1 ; off-sheet PMIC_SCLH
PMIC_SCLL: R712.2 U701.27(SCLL) ; off-sheet PMIC_SCLL
PMIC_SDAH: R725.1 ; off-sheet PMIC_SDAH
PMIC_SDAL: R713.2 U701.26(SDAL) ; off-sheet PMIC_SDAL
PMIC_STBY_REQ: R708.1 ; off-sheet PMIC_STBY_REQ
POR_B: U701.9(POR_B) ; off-sheet POR_B
SD2_nRST: R723.2 ; off-sheet SD2_nRST  [project net SD2_RESET_B]
SD2_VSEL: U701.29(SD_VSEL) ; off-sheet SD2_VSEL
SYS_nRST: R706.1 TP915.1(TP) ; off-sheet SYS_nRST
VINT: C706.1 U701.4(VINT)
WDOG_B: R710.1 TP916.1(TP) ; off-sheet WDOG_B
XIN_32K: C716.1 QZ701.2 R720.1 U701.10(XTAL_IN)
XOUT_32K: C717.1 QZ701.1 R720.2 U701.11(XTAL_OUT)
NetC710_1: C710.1 C711.1 L703.2 R709.2 R716.1
NetC728_1: C728.1 TP710.1(TP) U701.2(LDO2)
NetL701_1: L701.1 U701.45(LX2_1) U701.46(LX2_2)
NetL702_1: L702.1 U701.36(LX1_1) U701.37(LX1_2)
NetL703_1: L703.1 U701.31(LX3_1) U701.32(LX3_2)
NetL704_1: L704.1 U701.19(LX4_1) U701.20(LX4_2)
NetL705_1: L705.1 U701.15(LX5)
NetL706_1: L706.1 U701.50(LX6_1) U701.51(LX6_2)
NetR701_2: R701.2 R711.1 U701.38(R_SNSP1)
NetR703_2: R703.2 R706.2 U701.8(PMIC_RST_B)
NetR705_2: R705.2 R710.2 U701.28(WDOG_B)
NetR707_2: R707.2 U701.39(PMIC_ON_REQ)
NetR708_2: R708.2 U701.40(PMIC_STBY_REQ)
NetR714_2: R714.2 U701.41(SCL)
NetR715_2: R715.2 U701.42(SDA)
NetR716_2: R716.2 R718.1 U701.30(R_SNSP3_CFG)
NetR717_2: R717.2 R724.2 U701.25(SCLH)
NetR719_2: R719.2 R725.2 U701.24(SDAH)
NetR723_1: R723.1 U701.12(SW_EN)
NetTP714_1: TP714.1(TP) U701.6(RTC_RESET_B)

### Notes on the sheet
- SYS PMIC
- (near U701) 3A / 0.6V  DVS
- (near U701) 0.6V-2.1875V / 12.5mV
- (near U701) Sense from Processor power pin
- (near U701) 3A / 0.8V  DVS
- # System Reset Button
- OD+PU<LDO1>
- (near R709) # BUCK1&3 Dual Phase Mode
- (near U701) OD
- (near U701) Sense connect to GND for dual phase mode
- (near U701) <LDO1>
- (near U701) 0.6V-3.4V / 25mV
- (near U701) 3A / 3.3V
- Note:
- Add PU if using level translator (per DS). Float if unused.
- I2C ADDR: 0x25 (010 0101x)
- (near U701) 2A / 1.8V
- 1. PMIC_RST_B is used as Cold Reset as default.
- 2. WDOG_B is used as Cold Reset, external pull up is needed for BSDL mode.
- (near U701) 2A / 1.1V
- PMIC: PCA9451x CFG
- SEQ
- tstep=2ms
- REGULATOR
- VOL (V)
- MAX I (mA)
- PWR RAIL
- TYP VOL(V)
- REQ I (mA)
- -
- 1
- LDO1
- LDO2
- OFF
- 1.8
- 10
- NVCC_BBSM_1V8
- 2
- (near U701) 400mA / 3.3V
- PMIC_ON_REQ
- T1
- BUCK1/3 DP
- BUCK3
- 0.8
- 3000
- VDD_SOC
- Default: The R_SNSP3_CFG pin being tied to GND, BUCK1
  and BUCK3 are configured as dual phase mode. Curr 6A.
- 0.65-0.95
- 1500
- 3
- T2
- LDO4
- 200
- 186
- 4
- T3
- LDO3
- 300
- RFU: VDD_ANAx_1P8 (250mA)
- VDD_ANA_0P8
  VDD_MIPI_0P8
  VDD_USB_0P8
- 250
- (near U701) 1.6V-1.9V
  3.0V-3.3V / 100mV
- (near U701) 10mA / 1.8V
- 5
- T4
- BUCK5
- 2000
- 1040
- PERI INCLUDE
- (near U701) 0.85V-1.15V / 50mV
- (near U701) 10mA / 0.85V
- 6
- T5
- BUCK6
- 1.1
- VDD2_DDR
  VDDQ_DDR (1.1V for LPD4)
- VDD_ANAx_1P8
  VDD_LVDS_1P8
  VDD_MIPI_1P8
  VDD_USB_1P8
  NVCC_GPIO
- 676
- (near U701) 0.8V-3.3V / 100mV
- (near U701) 300mA / 1.8V
- 7
- T6
- BUCK2
- 0.6
- VDDQ_DDR (0.6V for LPD4x)
- 360
- (near U701) 200mA / 3.3V
- 8
- T7
- BUCK4
- 3.3
- NVCC_GPIO
  VDD_USB_3P3
- 2870
- 9
- T8
- LDO5
- Load Switch
- 1.8/3.3
- 150
- 400
- SD_CARD (from BUCK4 )
- NVCC_SD2
- (near U701) 150mA / (3.3V/1.8V)
- (near U701) 1.8V-3.3V / 100mV
- 12
- POR_B
- --
- REVISION
- DESCRIPTION
- DATE
- APPROVED
- F
- E
- D
- C
- B
- PROJECT:
- REV.
- ENG:
- APPROVALS
- PROJECT
- JordanDSP LLC <https://www.jordandsp.com>
- Envision Excellence
- SHT.
- A
- DSN:
- CHK:
- REFERENCE ITEMS
- PRJ VCS REVISION:
- TITLE
- DOC VCS REVISION:
- MODIFIED DATE:
- BOM:
- FAB DWG:
- FIRMWARE:
- ASSY DWG:
- SCALE:
- SIZE
- CAGE CODE
- FILE NAME
- DWG NO.
- PAGE
- PRODUCT REV
- OF
- (in symbol PCA9451AHNY, part C) INT LDO; I2C LF
- (in symbol TitleBlock_MCPG) Microcontroller Product Group; 6501 William Cannon Drive West / Austin, TX 78735-8598; This document contains information proprietary to NXP and shall not be used for engineering design,; procurement or manufacture in whole or in part without the express written permission of NXP Semiconductors.; ICAP Classification:; CP:; IUO:; PUBI:; Designer:; Drawing Title:; Drawn by:; Page Title:; Approved:; Size; Document Number; Rev; Date:; Sheet; of

### Library data of the parts
*#10 = TitleBlock_MCPG: as *#9 on sheet C-09 BOOT_CFG; Page Create Date: March  8, 1995; DrawnBy: NXP SE; FCP: ___; Page Modify Date: *
C701 C726 = CAP_NP: CAP CER 10.0uF 16V 10% X5R 0603; CLASS: DISCRETE; AGILE_PN: 150-80060; MFG_NAME01: MURATA; MFG_PN01: GRM188R61C106KAALD; Temp_Range: -55¡ãC to +85¡ãC; CAD_APPROVED: Yes; FPLIST: CC0603_OV,CC0603,0603_CC,cc0603_0805_nsp; PCB Footprint: CC0603; Tolerance: 10%; ROHS: Yes; HEIGHT: 0.9MM; Package Size: 0603; Package Type: SMT; Temp Range: -55¡ãC to +85¡ãC
C702 C709 C713 = CAP_NP: CAP CER 10.0uF 16V 10% X5R 0603; CLASS: DISCRETE; FPLIST: CC0603_OV,CC0603,0603_CC,cc0603_0805_nsp; CAD_APPROVED: Yes; Temp_Range: -55¡ãC to +85¡ãC; MFG_PN01: GRM188R61C106KAALD; MFG_NAME01: MURATA; AGILE_PN: 150-80060; PCB Footprint: CC0603; HEIGHT: 0.9MM; ROHS: Yes; Tolerance: 10%; Package Size: 0603; Package Type: SMT; Temp Range: -55¡ãC to +85¡ãC
C703 C710 C714 C719 C722 = CAP_NP: CAP CER 22uF 10V 20% X5R 0603; CLASS: DISCRETE; FPLIST: CC0603_OV,CC0603,0603_cc_tol; CAD_APPROVED: Yes; MFG_PN01: C1608X5R1A226M080AC; MFG_NAME01: TDK; AGILE_PN: 150-79530; WVDC: 6.3V; SIGNAL_MODEL: DEFAULT_CAPACITOR_2.2e+07pF_2_1; PCB Footprint: CC0603; HEIGHT: 1MM; ROHS: Yes; Tolerance: 20%; Package Size: 0603
C704 C724 = CAP_NP: CAP CER 1uF 16V 10% X5R 0402; CLASS: DISCRETE; AGILE_PN: 150-78973; FPLIST: CC0402_25,CC0402_HD,0402_CC,capc0402_l; CAD_APPROVED: Yes; MFG_NAME01: YAGEO; MFG_PN01: CC0402KRX5R7BB105; HEIGHT: 0.55 MM; Tolerance: 10%; ROHS: Yes; PCB Footprint: 0402_CC
C705 C711 C723 = CAP_NP: CAP CER 22uF 10V 20% X5R 0603; CLASS: DISCRETE; SIGNAL_MODEL: DEFAULT_CAPACITOR_2.2e+07pF_2_1; FPLIST: CC0603_OV,CC0603,0603_cc_tol; CAD_APPROVED: Yes; MFG_PN01: C1608X5R1A226M080AC; MFG_NAME01: TDK; AGILE_PN: 150-79530; WVDC: 6.3V; HEIGHT: 1MM; ROHS: Yes; Tolerance: 20%; Package Size: 0603; PCB Footprint: CC0603
C706 = CAP_NP: CAP CER 1uF 16V 10% X5R 0402; CLASS: DISCRETE; MFG_PN01: CC0402KRX5R7BB105; MFG_NAME01: YAGEO; CAD_APPROVED: Yes; FPLIST: CC0402_25,CC0402_HD,0402_CC,capc0402_l; AGILE_PN: 150-78973; ROHS: Yes; Tolerance: 10%; HEIGHT: 0.55 MM; PCB Footprint: 0402_CC
C707 = CAP_NP: CAP CER 22uF 10V 20% X5R 0603; CLASS: DISCRETE; SIGNAL_MODEL: DEFAULT_CAPACITOR_2.2e+07pF_2_1; WVDC: 6.3V; AGILE_PN: 150-79530; MFG_NAME01: TDK; MFG_PN01: C1608X5R1A226M080AC; CAD_APPROVED: Yes; FPLIST: CC0603_OV,CC0603,0603_cc_tol; PCB Footprint: CC0603; Tolerance: 20%; ROHS: Yes; HEIGHT: 1MM; Package Size: 0603
C708 C715 C720 = CAP_NP: CAP CER 22uF 10V 20% X5R 0603; CLASS: DISCRETE; WVDC: 6.3V; AGILE_PN: 150-79530; MFG_NAME01: TDK; MFG_PN01: C1608X5R1A226M080AC; CAD_APPROVED: Yes; FPLIST: CC0603_OV,CC0603,0603_cc_tol; SIGNAL_MODEL: DEFAULT_CAPACITOR_2.2e+07pF_2_1; Package Size: 0603; Tolerance: 20%; ROHS: Yes; HEIGHT: 1MM; PCB Footprint: CC0603
C712 C718 C721 = CAP_NP: CAP CER 10.0uF 16V 10% X5R 0603; CLASS: DISCRETE; Temp Range: -55¡ãC to +85¡ãC; AGILE_PN: 150-80060; MFG_NAME01: MURATA; MFG_PN01: GRM188R61C106KAALD; CAD_APPROVED: Yes; FPLIST: CC0603_OV,CC0603,0603_CC,cc0603_0805_nsp; PCB Footprint: CC0603; Package Type: SMT; Package Size: 0603; Tolerance: 10%; ROHS: Yes; Temp_Range: -55¡ãC to +85¡ãC; HEIGHT: 0.9MM
C716 C717 = CAP_NP: CAP CER 18pF 50V 5% C0G 0201; CLASS: DISCRETE; AGILE_PN: 150-79476; MFG_NAME01: MURATA; MFG_PN01: GRM0335C1H180JA01D; CAD_APPROVED: Yes; FPLIST: CC0201,CC0201_HD,0201_CC; Tolerance: 5%; ROHS: Yes; HEIGHT: 0.33MM; Package Size: 0201; Package Type: &#966;180mm Paper taping; PCB Footprint: 0201_CC
C725 = CAP_NP: as C501 on sheet C-08 eMMC; Tolerance: 10%; ROHS: Yes; HEIGHT: 0.65MM; PCB Footprint: cc0402_tol0p15; 3D_Mechanical_Footprint_File: cc0402_tol0p15
C727 C728 = CAP_NP: CAP CER 1.0uF 10V 10% X5R 0201; CLASS: DISCRETE; Temp Range: -55¡ãC to 85¡ãC; FPLIST: CC0201,CC0201_HD,0201_CC,cc_0201_cir; CAD_APPROVED: Yes; MFG_PN01: CL03A105KP3NSNC; MFG_NAME01: SAMSUNG ELECTRO MECHANICS; AGILE_PN: 150-81088; Package Type: SMD/SMT; Package Size: 0201 (0603 Metric); HEIGHT: 0.35MM; ROHS: Yes; Tolerance: 10%; PCB Footprint: 0201_CC
C729-C731 = CAP_NP: CAP CER 4.7uF 10V 10% X5R 0402; CLASS: DISCRETE; FPLIST: cc0402_tol0p15,cc0402_tol0p15_ov,0402_cc_nsp; CAD_APPROVED: Yes; MFG_PN01: CL05A475KP5NRNC; MFG_NAME01: SAMSUNG ELECTRO MECHANICS; AGILE_PN: 150-80044; HEIGHT: 0.65MM; ROHS: Yes; Tolerance: 10%; PCB Footprint: cc0402_tol0p15; 3D_Mechanical_Footprint_File: cc0402_tol0p15
L701 = INDUCTOR: IND PWR 0.47uH@1MHZ 4.7A 20% SMT; PART_TYPE: INDUCTOR\POWER; CLASS: DISCRETE; CAD_APPROVED: Yes; Temp_Range: -40¡ãC to +125¡ãC; MFG_PN01: WPN252012ER47MT; MFG_NAME01: SHENZHEN SUNLORD ELECTRONICS CO., LTD; AGILE_PN: 180-78647; PCB Footprint: ind_sph2520; Tolerance: 20%; HEIGHT: 1.2MM; ROHS: Yes; TOL: 20%; Temp Range: -40¡ãC to +125¡ãC
L702-L704 = INDUCTOR: IND PWR 0.47uH@1MHZ 4.7A 20% SMT; PART_TYPE: INDUCTOR\POWER; CLASS: DISCRETE; Temp Range: -40¡ãC to +125¡ãC; AGILE_PN: 180-78647; MFG_NAME01: SHENZHEN SUNLORD ELECTRONICS CO., LTD; MFG_PN01: WPN252012ER47MT; CAD_APPROVED: Yes; PCB Footprint: ind_sph2520; Tolerance: 20%; TOL: 20%; ROHS: Yes; Temp_Range: -40¡ãC to +125¡ãC; HEIGHT: 1.2MM
L705 = INDUCTOR: IND PWR 0.47uH@1MHz 3.4A 20% 2016; PART_TYPE: INDUCTOR\POWER; CLASS: DISCRETE; Temp Range: -40¡ãC to 125¡ãC; CAD_APPROVED: Yes; MFG_PN01: WPN201612HR47MT; MFG_NAME01: SHENZHEN SUNLORD ELECTRONICS CO., LTD; AGILE_PN: 180-78995; PCB Footprint: IND_2016A; Package Size: 2x1.6x1.2 mm; HEIGHT: 1.2MM; Temp_Range: -40¡ãC to 125¡ãC; ROHS: Yes; Tolerance: 20%
L706 = INDUCTOR: IND PWR 0.47uH@1MHz 3.4A 20% 2016; PART_TYPE: INDUCTOR\POWER; CLASS: DISCRETE; Temp Range: -40¡ãC to 125¡ãC; AGILE_PN: 180-78995; MFG_NAME01: SHENZHEN SUNLORD ELECTRONICS CO., LTD; MFG_PN01: WPN201612HR47MT; CAD_APPROVED: Yes; PCB Footprint: IND_2016A; Package Size: 2x1.6x1.2 mm; Tolerance: 20%; ROHS: Yes; Temp_Range: -40¡ãC to 125¡ãC; HEIGHT: 1.2MM
QZ701 = XTAL: XTAL 32.768KHZ 12.5PF 20PPM 3.2X1.5MM SMT; CLASS: IC; CAD_APPROVED: Yes; MFG_PN01: ABS07-32.768KHZ-T; MFG_NAME01: Abracon Corporation; AGILE_PN: 230-77653; HEIGHT: 0.9MM; ROHS: Yes; PCB Footprint: XTAL2-3P2X1P5-SM
R701 R706 R714 R715 = RES: RES MF ZERO OHM 1/16W 5% 0402; CLASS: DISCRETE; AGILE_PN: 470-75394; MFG_NAME01: YAGEO AMERICA; MFG_PN01: RC0402JR-070RL; CAD_APPROVED: Yes; FPLIST: RC0402_25,RC0402_HD,RC0402_X2,0402_CC; PCB Footprint: 0402_CC; VOLTAGE: 1/16W; Tolerance: 5%; ROHS: Yes; HEIGHT: 0.45 MM
R702 R709 = RES: RES MF ZERO OHM 1/10W -- 0603; CLASS: DISCRETE; AGILE_PN: 470-80866; MFG_NAME01: WALSIN TECHNOLOGY CORP.; MFG_PN01: WR06X000PTL; CAD_APPROVED: Yes; FPLIST: RC0603_OV,RC0603,R603-X2,0603_CC,IND_0603HP_NSP,CC0603_OV_NSP; Temp Range: ¨C55 ¡ãC to +155 ¡ãC; PCB Footprint: 0603_CC; ROHS: Yes; HEIGHT: 0.6MM
R703 = RES: RES MF 100K 1/16W 5% 0402; CLASS: DISCRETE; AGILE_PN: 470-75597; MFG_NAME01: VENKEL COMPANY; MFG_PN01: CR0402-16W-104JT; CAD_APPROVED: Yes; FPLIST: RC0402_25,RC0402_HD,0402_CC; VOLTAGE: 50V; Temp Range: -55C to +155C; PCB Footprint: 0402_CC; Tolerance: 5%; ROHS: Yes; HEIGHT: 0.40 MM
R704 = RES: RES MF ZERO OHM 1/10W -- 0603; CLASS: DISCRETE; Temp Range: ¨C55 ¡ãC to +155 ¡ãC; FPLIST: RC0603_OV,RC0603,R603-X2,0603_CC,IND_0603HP_NSP,CC0603_OV_NSP; CAD_APPROVED: Yes; MFG_PN01: WR06X000PTL; MFG_NAME01: WALSIN TECHNOLOGY CORP.; AGILE_PN: 470-80866; PCB Footprint: 0603_CC; HEIGHT: 0.6MM; ROHS: Yes
R705 = RES: RES MF 100K 1/16W 5% 0402; CLASS: DISCRETE; Temp Range: -55C to +155C; VOLTAGE: 50V; AGILE_PN: 470-75597; MFG_NAME01: VENKEL COMPANY; MFG_PN01: CR0402-16W-104JT; CAD_APPROVED: Yes; FPLIST: RC0402_25,RC0402_HD,0402_CC; PCB Footprint: 0402_CC; Tolerance: 5%; ROHS: Yes; HEIGHT: 0.40 MM
R707 R708 R710 R711 R716 R718 R723 = RES: RES MF ZERO OHM 1/16W 5% 0402; CLASS: DISCRETE; FPLIST: RC0402_25,RC0402_HD,RC0402_X2,0402_CC; CAD_APPROVED: Yes; MFG_PN01: RC0402JR-070RL; MFG_NAME01: YAGEO AMERICA; AGILE_PN: 470-75394; PCB Footprint: 0402_CC; HEIGHT: 0.45 MM; ROHS: Yes; Tolerance: 5%; VOLTAGE: 1/16W
R712 = RES: RES MF 4.7K 1/10W 5% AEC-Q200 0402; CLASS: DISCRETE; AGILE_PN: 470-82064; MFG_NAME01: KOA SPEER; MFG_PN01: RK73B1ETTP472J; Temp_Range: -55C to +155C; CAD_APPROVED: Yes; FPLIST: RC0402_25,RC0402_HD,0402_CC,RC0402_X2; VOLTAGE: 50V; PCB Footprint: 0402_CC; Tolerance: 5%; ROHS: Yes; HEIGHT: 0.41mm; Temp Range: -55C to +155C
R713 = RES: RES MF 4.7K 1/10W 5% AEC-Q200 0402; CLASS: DISCRETE; VOLTAGE: 50V; Temp Range: -55C to +155C; FPLIST: RC0402_25,RC0402_HD,0402_CC,RC0402_X2; CAD_APPROVED: Yes; MFG_PN01: RK73B1ETTP472J; MFG_NAME01: KOA SPEER; AGILE_PN: 470-82064; PCB Footprint: 0402_CC; HEIGHT: 0.41mm; Temp_Range: -55C to +155C; ROHS: Yes; Tolerance: 5%
R717 R719 R724 R725 = RES: RES MF ZERO OHM 1/20W -- 0201; CLASS: DISCRETE; AGILE_PN: 470-76631; MFG_NAME01: BOURNS; MFG_PN01: CR0201-J/-000GLF; CAD_APPROVED: Yes; FPLIST: RC0201,0201_CC,RC0201_X2; PCB Footprint: 0201_CC; ROHS: Yes; HEIGHT: 0.30 MM
R720 = RES: RES MF 1.0M 1/20W 5% AEC-Q200 0201; CLASS: DISCRETE; FPLIST: RC0201,0201_CC; CAD_APPROVED: Yes; Temp_Range: 55¡ãC ~ 125¡ãC; MFG_PN01: ERJ-1GNJ105C; MFG_NAME01: PANASONIC; AGILE_PN: 470-79975; VOLTAGE: 25V; PCB Footprint: 0201_CC; HEIGHT: 0.26MM; ROHS: Yes; Tolerance: 5%; Temp Range: 55¡ãC ~ 125¡ãC
R726 R727 = RES: RES MF ZERO OHM 1/8W -- 0805; CLASS: DISCRETE; MFG_PN01: RC0805JR-070RL; MFG_NAME01: YAGEO AMERICA; Temp Range: ¨C55 ¡ãC to +155 ¡ãC; CAD_APPROVED: Yes; Tolerance: 5%; FPLIST: RC0805_OV,RC0805,RC0805_OV_3P,0805_CC; AGILE_PN: 470-75442; ROHS: Yes; HEIGHT: 0.7 MM; PCB Footprint: RC0805_OV
TP702 TP703 TP706 TP708 TP709 TP711-TP714 = T POINT R: as TP603 on sheet C-09 BOOT_CFG; PCB Footprint: testpoint_35mil; HEIGHT: 0.1MM; ROHS: Yes
TP707 TP710 = T POINT R: as TP604 on sheet C-09 BOOT_CFG; PCB Footprint: testpoint_35mil; ROHS: Yes; HEIGHT: 0.1MM
TP915 TP916 = T POINT R: TEST POINT PAD .035 SMT, no part to order; CLASS: IC; AGILE_PN: 510-75618; CAD_APPROVED: Yes; PCB Footprint: testpoint_35mil; HEIGHT: 0.1MM; ROHS: Yes
U701 = PCA9451AHNY: IC POWER MANAGEMENT 2.7-5.5V HVQFN56; SWAP_INFO: (S1+S2+S3); SPLIT_INST: TRUE; AGILE_PN: TMP-CIP-8249; CAD_APPROVED: Yes; PRE_APN: 315-83273; MFG_NAME01: NXP SEMICONDUCTORS; 3D_Mechanical_Footprint_File: ftp://fcl.am.freescale.net/ALLEGRO/step/hvqfn56_0p4_7x7_ep4p7mm.step; CLASS: IC; PCB Footprint: hvqfn56_0p4_7x7_ep4p7mm; Package Size: 7x7; HEIGHT: 1MM; ROHS: Yes; MFG_PN01: PCA9451AHNY

## Sheet C-11 SOM HDR.SchDoc
size 513 x 386 mm; Address1: 350W 9th Ave; Address2: Suite 206; Address3: Escondido CA 92025; Address4: United States; Revision: -; ENG_APP_DATE: --/--/--; DSN_APP_DATE: --/--/--; CHK_APP_DATE: --/--/--
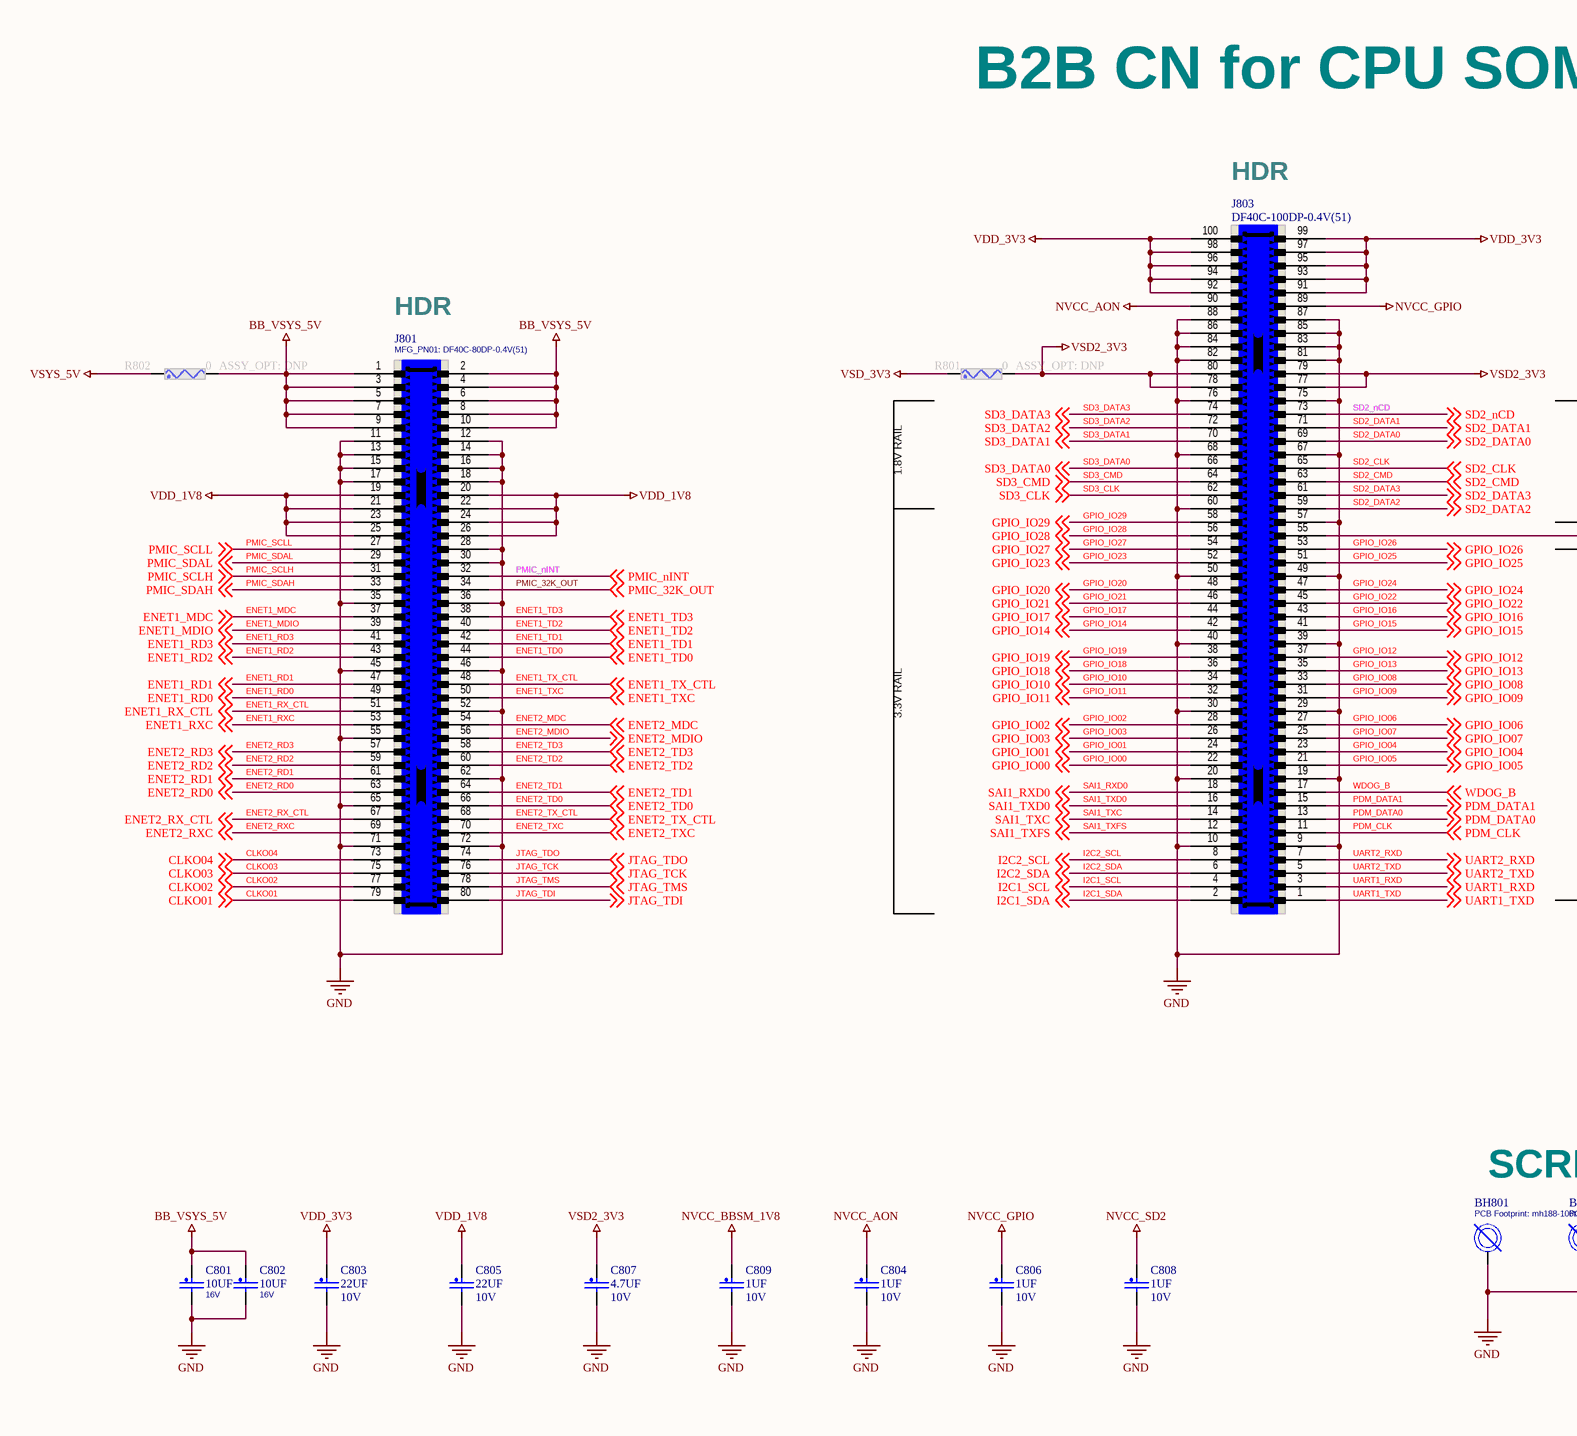
[diagram p20: C-11 SOM HDR.SchDoc, left]
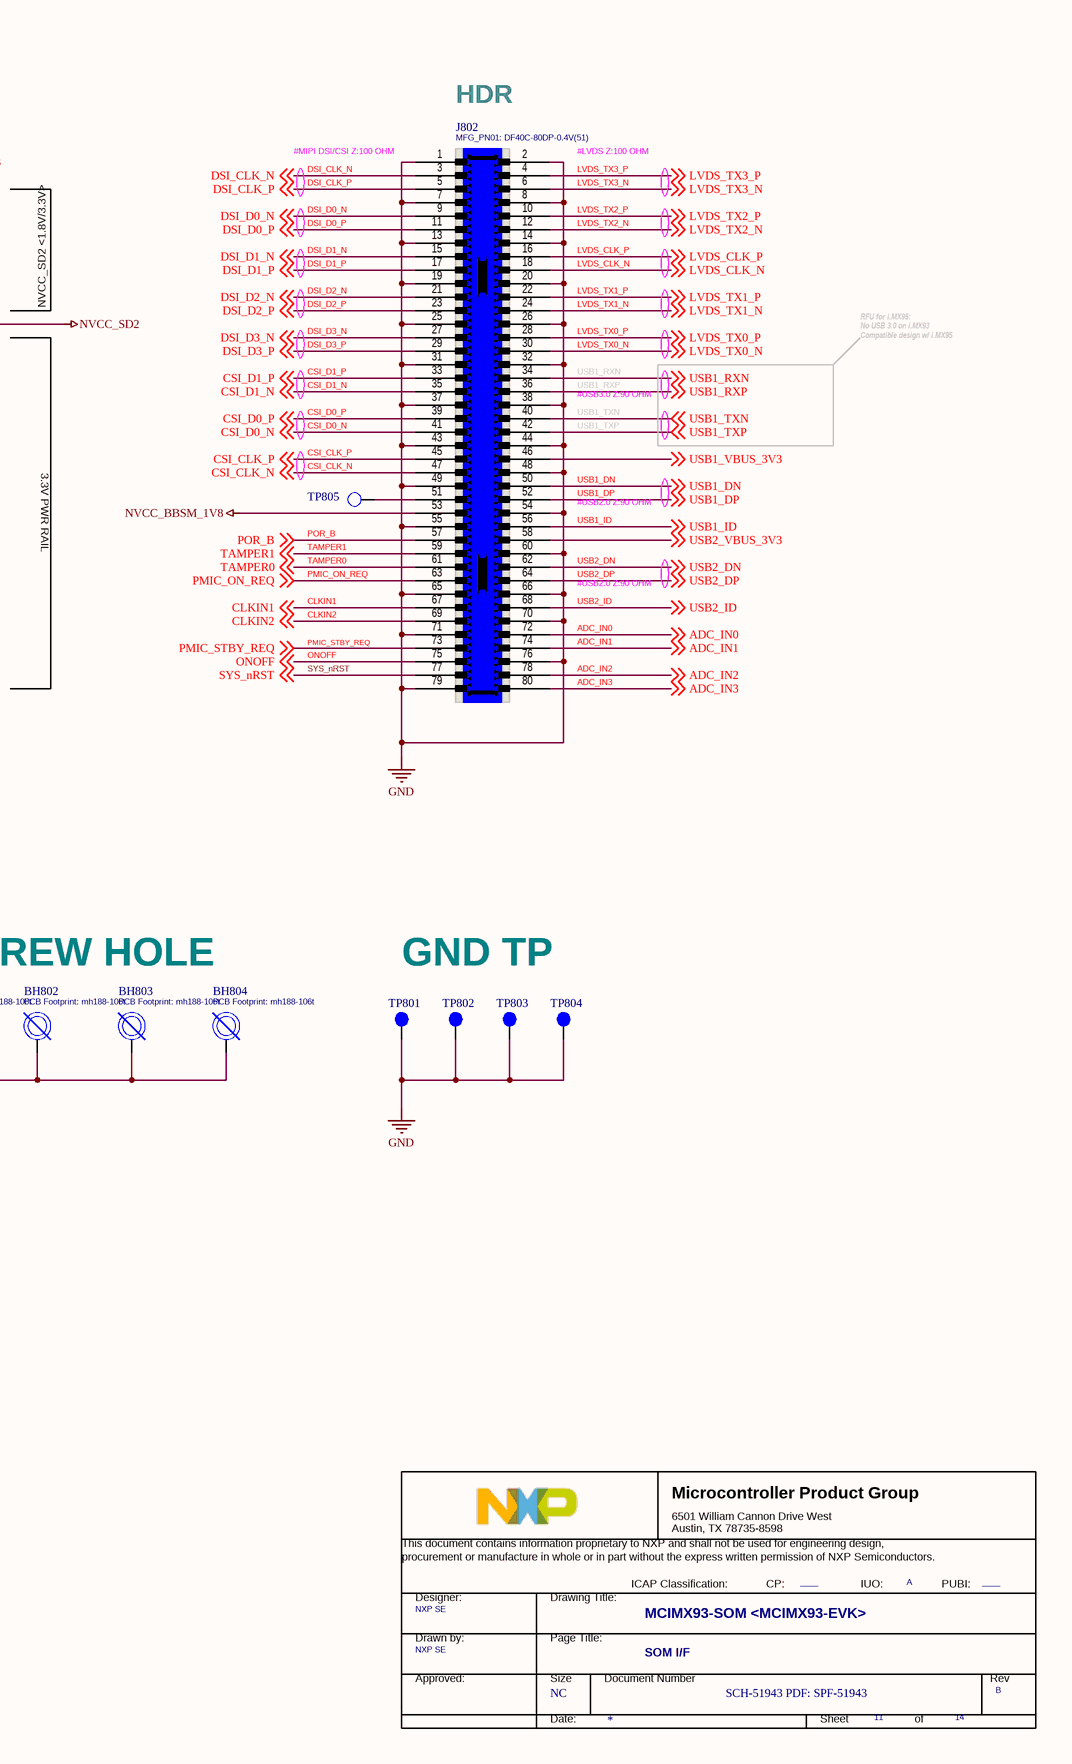
[diagram p21: C-11 SOM HDR.SchDoc, right]

### Parts
(Parts that share a designator on the sheet are numbered #1, #2 ... from top to bottom, then left to right.)
*#11  Doc: SCH-51943 PDF: SPF-51943  RevCode: B  Title: MCIMX93-SOM <MCIMX93-EVK>  Page Size: NC  Page Number: 11  Page Count: 14  PageTitle: SOM I/F  Designer: NXP SE  PUBI: ____  FIUO: A  (hidden comment: TitleBlock_MCPG)  (graphical)
BH801  FMC MOUNTING HOLE  [mh188-106t]  (value not drawn)
BH802  FMC MOUNTING HOLE  [mh188-106t]  (value not drawn)
BH803  FMC MOUNTING HOLE  [mh188-106t]  (value not drawn)
BH804  FMC MOUNTING HOLE  [mh188-106t]  (value not drawn)
C801  10UF  VOLTAGE: 16V  [CC0603]
C802  10UF  VOLTAGE: 16V  [CC0603]
C803  22UF  VOLTAGE: 10V  [CC0603]
C804  1UF  VOLTAGE: 10V  [0201_CC]
C805  22UF  VOLTAGE: 10V  [CC0603]
C806  1UF  VOLTAGE: 10V  [0201_CC]
C807  4.7UF  VOLTAGE: 10V  [cc0402_tol0p15]
C808  1UF  VOLTAGE: 10V  [0201_CC]
C809  1UF  VOLTAGE: 10V  [0201_CC]
J801  MFG_PN01: DF40C-80DP-0.4V(51)  [con80_0p4_17p7x2p05_sm]  (hidden comment: CON 2X40)
J802  MFG_PN01: DF40C-80DP-0.4V(51)  [con80_0p4_17p7x2p05_sm]  (hidden comment: CON 2X40)
J803  DF40C-100DP-0.4V(51)  [con100_0p4_21p7x2p05_sm]
R801  0  ASSY_OPT: DNP  [0603_CC]
R802  0  ASSY_OPT: DNP  [RC0805_OV]
TP801  TPAD_050  [TPAD_050]  (value not drawn)  (no BOM)
TP802  TPAD_050  [TPAD_050]  (value not drawn)  (no BOM)
TP803  TPAD_050  [TPAD_050]  (value not drawn)  (no BOM)
TP804  TPAD_050  [TPAD_050]  (value not drawn)  (no BOM)
TP805  TP_35MIL  [testpoint_35mil]  (value not drawn)  (no BOM)

### Nets
BB_VSYS_5V: C801.1 C802.1 J801.1(A1) J801.2(B1) J801.3(A2) J801.4(B2) J801.5(A3) J801.6(B3) J801.7(A4) J801.8(B4) J801.9(A5) J801.10(B5) R802.2
GND: BH801.1 BH802.1 BH803.1 BH804.1 C801.2 C802.2 C803.2 C804.2 C805.2 C806.2 C807.2 C808.2 C809.2 J801.11(A6) J801.12(B6) J801.13(A7) J801.14(B7) J801.15(A8) J801.16(B8) J801.17(A9) J801.18(B9) J801.28(B14) J801.30(B15) J801.35(A18) J801.36(B18) J801.45(A23) J801.46(B23) J801.52(B26) J801.55(A28) J801.62(B31) J801.65(A33) J801.71(A36) J801.72(B36) J802.1(A1) J802.2(B1) J802.7(A4) J802.8(B4) J802.13(A7) J802.14(B7) J802.19(A10) J802.20(B10) J802.25(A13) J802.26(B13) J802.31(A16) J802.32(B16) J802.37(A19) J802.38(B19) J802.43(A22) J802.44(B22) J802.48(B24) J802.49(A25) J802.54(B27) J802.55(A28) J802.60(B30) J802.65(A33) J802.66(B33) J802.70(B35) J802.71(A36) J802.76(B38) J802.79(A40) J803.9 J803.10 J803.19 J803.20 J803.29 J803.30 J803.39 J803.40 J803.49 J803.50 J803.57 J803.60 J803.67 J803.68 J803.75 J803.76 J803.81 J803.82 J803.83 J803.84 J803.85 J803.86 J803.87 J803.88 TP801.1(Pin1) TP802.1(Pin1) TP803.1(Pin1) TP804.1(Pin1)
NVCC_AON: C804.1 J803.90
NVCC_BBSM_1V8: C809.1 J802.53(A27)
NVCC_GPIO: C806.1 J803.89
NVCC_SD2: C808.1 J803.55
VDD_1V8: C805.1 J801.19(A10) J801.20(B10) J801.21(A11) J801.22(B11) J801.23(A12) J801.24(B12) J801.25(A13) J801.26(B13)
VDD_3V3: C803.1 J803.91 J803.92 J803.93 J803.94 J803.95 J803.96 J803.97 J803.98 J803.99 J803.100
VSD2_3V3: C807.1 J803.77 J803.78 J803.79 J803.80 R801.2
VSD_3V3: R801.1
VSYS_5V: R802.1
ADC_IN0: J802.72(B36) ; off-sheet ADC_IN0
ADC_IN1: J802.74(B37) ; off-sheet ADC_IN1
ADC_IN2: J802.78(B39) ; off-sheet ADC_IN2
ADC_IN3: J802.80(B40) ; off-sheet ADC_IN3
CLKIN1: J802.67(A34) ; off-sheet CLKIN1
CLKIN2: J802.69(A35) ; off-sheet CLKIN2
CLKO01: J801.79(A40) ; off-sheet CLKO01
CLKO02: J801.77(A39) ; off-sheet CLKO02
CLKO03: J801.75(A38) ; off-sheet CLKO03
CLKO04: J801.73(A37) ; off-sheet CLKO04
CSI_CLK_N: J802.47(A24) ; off-sheet CSI_CLK_N
CSI_CLK_P: J802.45(A23) ; off-sheet CSI_CLK_P
CSI_D0_N: J802.41(A21) ; off-sheet CSI_D0_N
CSI_D0_P: J802.39(A20) ; off-sheet CSI_D0_P
CSI_D1_N: J802.35(A18) ; off-sheet CSI_D1_N
CSI_D1_P: J802.33(A17) ; off-sheet CSI_D1_P
DSI_CLK_N: J802.3(A2) ; off-sheet DSI_CLK_N
DSI_CLK_P: J802.5(A3) ; off-sheet DSI_CLK_P
DSI_D0_N: J802.9(A5) ; off-sheet DSI_D0_N
DSI_D0_P: J802.11(A6) ; off-sheet DSI_D0_P
DSI_D1_N: J802.15(A8) ; off-sheet DSI_D1_N
DSI_D1_P: J802.17(A9) ; off-sheet DSI_D1_P
DSI_D2_N: J802.21(A11) ; off-sheet DSI_D2_N
DSI_D2_P: J802.23(A12) ; off-sheet DSI_D2_P
DSI_D3_N: J802.27(A14) ; off-sheet DSI_D3_N
DSI_D3_P: J802.29(A15) ; off-sheet DSI_D3_P
ENET1_MDC: J801.37(A19) ; off-sheet ENET1_MDC
ENET1_MDIO: J801.39(A20) ; off-sheet ENET1_MDIO
ENET1_RD0: J801.49(A25) ; off-sheet ENET1_RD0
ENET1_RD1: J801.47(A24) ; off-sheet ENET1_RD1
ENET1_RD2: J801.43(A22) ; off-sheet ENET1_RD2
ENET1_RD3: J801.41(A21) ; off-sheet ENET1_RD3
ENET1_RX_CTL: J801.51(A26) ; off-sheet ENET1_RX_CTL
ENET1_RXC: J801.53(A27) ; off-sheet ENET1_RXC
ENET1_TD0: J801.44(B22) ; off-sheet ENET1_TD0
ENET1_TD1: J801.42(B21) ; off-sheet ENET1_TD1
ENET1_TD2: J801.40(B20) ; off-sheet ENET1_TD2
ENET1_TD3: J801.38(B19) ; off-sheet ENET1_TD3
ENET1_TX_CTL: J801.48(B24) ; off-sheet ENET1_TX_CTL
ENET1_TXC: J801.50(B25) ; off-sheet ENET1_TXC
ENET2_MDC: J801.54(B27) ; off-sheet ENET2_MDC
ENET2_MDIO: J801.56(B28) ; off-sheet ENET2_MDIO
ENET2_RD0: J801.63(A32) ; off-sheet ENET2_RD0
ENET2_RD1: J801.61(A31) ; off-sheet ENET2_RD1
ENET2_RD2: J801.59(A30) ; off-sheet ENET2_RD2
ENET2_RD3: J801.57(A29) ; off-sheet ENET2_RD3
ENET2_RX_CTL: J801.67(A34) ; off-sheet ENET2_RX_CTL
ENET2_RXC: J801.69(A35) ; off-sheet ENET2_RXC
ENET2_TD0: J801.66(B33) ; off-sheet ENET2_TD0
ENET2_TD1: J801.64(B32) ; off-sheet ENET2_TD1
ENET2_TD2: J801.60(B30) ; off-sheet ENET2_TD2
ENET2_TD3: J801.58(B29) ; off-sheet ENET2_TD3
ENET2_TX_CTL: J801.68(B34) ; off-sheet ENET2_TX_CTL
ENET2_TXC: J801.70(B35) ; off-sheet ENET2_TXC
GPIO_IO00: J803.22 ; off-sheet GPIO_IO00
GPIO_IO01: J803.24 ; off-sheet GPIO_IO01
GPIO_IO02: J803.28 ; off-sheet GPIO_IO02
GPIO_IO03: J803.26 ; off-sheet GPIO_IO03
GPIO_IO04: J803.23 ; off-sheet GPIO_IO04
GPIO_IO05: J803.21 ; off-sheet GPIO_IO05
GPIO_IO06: J803.27 ; off-sheet GPIO_IO06
GPIO_IO07: J803.25 ; off-sheet GPIO_IO07
GPIO_IO08: J803.33 ; off-sheet GPIO_IO08
GPIO_IO09: J803.31 ; off-sheet GPIO_IO09
GPIO_IO10: J803.34 ; off-sheet GPIO_IO10
GPIO_IO11: J803.32 ; off-sheet GPIO_IO11
GPIO_IO12: J803.37 ; off-sheet GPIO_IO12
GPIO_IO13: J803.35 ; off-sheet GPIO_IO13
GPIO_IO14: J803.42 ; off-sheet GPIO_IO14
GPIO_IO15: J803.41 ; off-sheet GPIO_IO15
GPIO_IO16: J803.43 ; off-sheet GPIO_IO16
GPIO_IO17: J803.44 ; off-sheet GPIO_IO17
GPIO_IO18: J803.36 ; off-sheet GPIO_IO18
GPIO_IO19: J803.38 ; off-sheet GPIO_IO19
GPIO_IO20: J803.48 ; off-sheet GPIO_IO20
GPIO_IO21: J803.46 ; off-sheet GPIO_IO21
GPIO_IO22: J803.45 ; off-sheet GPIO_IO22
GPIO_IO23: J803.52 ; off-sheet GPIO_IO23
GPIO_IO24: J803.47 ; off-sheet GPIO_IO24
GPIO_IO25: J803.51 ; off-sheet GPIO_IO25
GPIO_IO26: J803.53 ; off-sheet GPIO_IO26
GPIO_IO27: J803.54 ; off-sheet GPIO_IO27
GPIO_IO28: J803.56 ; off-sheet GPIO_IO28
GPIO_IO29: J803.58 ; off-sheet GPIO_IO29
I2C1_SCL: J803.4 ; off-sheet I2C1_SCL
I2C1_SDA: J803.2 ; off-sheet I2C1_SDA
I2C2_SCL: J803.8 ; off-sheet I2C2_SCL
I2C2_SDA: J803.6 ; off-sheet I2C2_SDA
JTAG_TCK: J801.76(B38) ; off-sheet JTAG_TCK
JTAG_TDI: J801.80(B40) ; off-sheet JTAG_TDI
JTAG_TDO: J801.74(B37) ; off-sheet JTAG_TDO
JTAG_TMS: J801.78(B39) ; off-sheet JTAG_TMS
LVDS_CLK_N: J802.18(B9) ; off-sheet LVDS_CLK_N
LVDS_CLK_P: J802.16(B8) ; off-sheet LVDS_CLK_P
LVDS_TX0_N: J802.30(B15) ; off-sheet LVDS_TX0_N
LVDS_TX0_P: J802.28(B14) ; off-sheet LVDS_TX0_P
LVDS_TX1_N: J802.24(B12) ; off-sheet LVDS_TX1_N
LVDS_TX1_P: J802.22(B11) ; off-sheet LVDS_TX1_P
LVDS_TX2_N: J802.12(B6) ; off-sheet LVDS_TX2_N
LVDS_TX2_P: J802.10(B5) ; off-sheet LVDS_TX2_P
LVDS_TX3_N: J802.6(B3) ; off-sheet LVDS_TX3_N
LVDS_TX3_P: J802.4(B2) ; off-sheet LVDS_TX3_P
ONOFF: J802.75(A38) ; off-sheet ONOFF
PDM_CLK: J803.11 ; off-sheet PDM_CLK
PDM_DATA0: J803.13 ; off-sheet PDM_DATA0
PDM_DATA1: J803.15 ; off-sheet PDM_DATA1
PMIC_32K_OUT: J801.34(B17) ; off-sheet PMIC_32K_OUT
PMIC_nINT: J801.32(B16) ; off-sheet PMIC_nINT
PMIC_ON_REQ: J802.63(A32) ; off-sheet PMIC_ON_REQ
PMIC_SCLH: J801.31(A16) ; off-sheet PMIC_SCLH
PMIC_SCLL: J801.27(A14) ; off-sheet PMIC_SCLL
PMIC_SDAH: J801.33(A17) ; off-sheet PMIC_SDAH
PMIC_SDAL: J801.29(A15) ; off-sheet PMIC_SDAL
PMIC_STBY_REQ: J802.73(A37) ; off-sheet PMIC_STBY_REQ
POR_B: J802.57(A29) ; off-sheet POR_B
SAI1_RXD0: J803.18 ; off-sheet SAI1_RXD0
SAI1_TXC: J803.14 ; off-sheet SAI1_TXC
SAI1_TXD0: J803.16 ; off-sheet SAI1_TXD0
SAI1_TXFS: J803.12 ; off-sheet SAI1_TXFS
SD2_CLK: J803.65 ; off-sheet SD2_CLK
SD2_CMD: J803.63 ; off-sheet SD2_CMD
SD2_DATA0: J803.69 ; off-sheet SD2_DATA0
SD2_DATA1: J803.71 ; off-sheet SD2_DATA1
SD2_DATA2: J803.59 ; off-sheet SD2_DATA2
SD2_DATA3: J803.61 ; off-sheet SD2_DATA3
SD2_nCD: J803.73 ; off-sheet SD2_nCD
SD3_CLK: J803.62 ; off-sheet SD3_CLK
SD3_CMD: J803.64 ; off-sheet SD3_CMD
SD3_DATA0: J803.66 ; off-sheet SD3_DATA0
SD3_DATA1: J803.70 ; off-sheet SD3_DATA1
SD3_DATA2: J803.72 ; off-sheet SD3_DATA2
SD3_DATA3: J803.74 ; off-sheet SD3_DATA3
SYS_nRST: J802.77(A39) ; off-sheet SYS_nRST
TAMPER0: J802.61(A31) ; off-sheet TAMPER0
TAMPER1: J802.59(A30) ; off-sheet TAMPER1
UART1_RXD: J803.3 ; off-sheet UART1_RXD
UART1_TXD: J803.1 ; off-sheet UART1_TXD
UART2_RXD: J803.7 ; off-sheet UART2_RXD
UART2_TXD: J803.5 ; off-sheet UART2_TXD
USB1_DN: J802.50(B25) ; off-sheet USB1_DN
USB1_DP: J802.52(B26) ; off-sheet USB1_DP
USB1_ID: J802.56(B28) ; off-sheet USB1_ID
USB1_RXN: J802.34(B17) ; off-sheet USB1_RXN
USB1_RXP: J802.36(B18) ; off-sheet USB1_RXP
USB1_TXN: J802.40(B20) ; off-sheet USB1_TXN
USB1_TXP: J802.42(B21) ; off-sheet USB1_TXP
USB1_VBUS_3V3: J802.46(B23) ; off-sheet USB1_VBUS_3V3
USB2_DN: J802.62(B31) ; off-sheet USB2_DN
USB2_DP: J802.64(B32) ; off-sheet USB2_DP
USB2_ID: J802.68(B34) ; off-sheet USB2_ID
USB2_VBUS_3V3: J802.58(B29) ; off-sheet USB2_VBUS_3V3
WDOG_B: J803.17 ; off-sheet WDOG_B
NetJ802_51: J802.51(A26) TP805.1(TP)

### Notes on the sheet
- B2B CN for CPU SOM
- (near J803) HDR
- (near J801) HDR
- (near J802) HDR
- #MIPI DSI/CSI Z:100 OHM
- #LVDS Z:100 OHM
- 1.8V RAIL
- NVCC_SD2 <1.8V/3.3V>
- RFU for i.MX95:
  No USB 3.0 on i.MX93
  Compatible design w/ i.MX95
- #USB3.0 Z:90 OHM
- 3.3V PWR RAIL
- 3.3V RAIL
- #USB2.0 Z:90 OHM
- SCREW HOLE
- GND TP
- 8
- 7
- 6
- 5
- 4
- 3
- 2
- 1
- REVISION
- DESCRIPTION
- DATE
- APPROVED
- F
- E
- D
- C
- B
- PROJECT:
- REV.
- ENG:
- APPROVALS
- PROJECT
- JordanDSP LLC <https://www.jordandsp.com>
- Envision Excellence
- SHT.
- A
- DSN:
- CHK:
- REFERENCE ITEMS
- PRJ VCS REVISION:
- TITLE
- DOC VCS REVISION:
- MODIFIED DATE:
- BOM:
- FAB DWG:
- FIRMWARE:
- ASSY DWG:
- SCALE:
- SIZE
- CAGE CODE
- FILE NAME
- DWG NO.
- PAGE
- PRODUCT REV
- OF
- (in symbol TitleBlock_MCPG) Microcontroller Product Group; 6501 William Cannon Drive West / Austin, TX 78735-8598; This document contains information proprietary to NXP and shall not be used for engineering design,; procurement or manufacture in whole or in part without the express written permission of NXP Semiconductors.; ICAP Classification:; CP:; IUO:; PUBI:; Designer:; Drawing Title:; Drawn by:; Page Title:; Approved:; Size; Document Number; Rev; Date:; Sheet; of

### Library data of the parts
*#11 = TitleBlock_MCPG: as *#9 on sheet C-09 BOOT_CFG; Page Create Date: March  8, 1995; DrawnBy: NXP SE; FCP: ____; Page Modify Date: *
BH801-BH803 = MOUNT_HOLE: MOUNTING HOLE PLATED DRILL 2.7MM KEEPOUT R2.9MM TH, NO PART TO ORDER; CLASS: IC; MFG_PN01: NOTACOMPONENT; CAD_APPROVED: Yes; AGILE_PN: 280-76791; MFG_NAME01: NOTACOMPONENT; ROHS: Yes; HEIGHT: 0.1MM; PCB Footprint: mh188-106t
BH804 = MOUNT_HOLE: MOUNTING HOLE PLATED DRILL 2.7MM KEEPOUT R2.9MM TH, NO PART TO ORDER; CLASS: IC; AGILE_PN: 280-76791; CAD_APPROVED: Yes; MFG_NAME01: NOTACOMPONENT; HEIGHT: 0.1MM; ROHS: Yes; MFG_PN01: NOTACOMPONENT; PCB Footprint: mh188-106t
C801 = CAP_NP: as C701 on sheet C-10 PMIC; Tolerance: 10%; ROHS: Yes; HEIGHT: 0.9MM; Package Size: 0603; Package Type: SMT; Temp Range: -55¡ãC to +85¡ãC; PCB Footprint: CC0603
C802 = CAP_NP: as C702 on sheet C-10 PMIC; HEIGHT: 0.9MM; ROHS: Yes; Tolerance: 10%; Package Size: 0603; Package Type: SMT; Temp Range: -55¡ãC to +85¡ãC; PCB Footprint: CC0603
C803 C805 = CAP_NP: as C705 on sheet C-10 PMIC; HEIGHT: 1MM; ROHS: Yes; Tolerance: 20%; Package Size: 0603; PCB Footprint: CC0603
C804 C806 C809 = CAP_NP: CAP CER 1.0uF 10V 10% X5R 0201; CLASS: DISCRETE; Temp Range: -55¡ãC to 85¡ãC; AGILE_PN: 150-81088; MFG_NAME01: SAMSUNG ELECTRO MECHANICS; MFG_PN01: CL03A105KP3NSNC; CAD_APPROVED: Yes; FPLIST: CC0201,CC0201_HD,0201_CC,cc_0201_cir; Tolerance: 10%; ROHS: Yes; HEIGHT: 0.35MM; Package Size: 0201 (0603 Metric); Package Type: SMD/SMT; PCB Footprint: 0201_CC
C807 = CAP_NP: as C729 on sheet C-10 PMIC; HEIGHT: 0.65MM; ROHS: Yes; Tolerance: 10%; PCB Footprint: cc0402_tol0p15; 3D_Mechanical_Footprint_File: cc0402_tol0p15
C808 = CAP_NP: CAP CER 1.0uF 10V 10% X5R 0201; CLASS: DISCRETE; FPLIST: CC0201,CC0201_HD,0201_CC,cc_0201_cir; CAD_APPROVED: Yes; MFG_PN01: CL03A105KP3NSNC; MFG_NAME01: SAMSUNG ELECTRO MECHANICS; AGILE_PN: 150-81088; Temp Range: -55¡ãC to 85¡ãC; Package Type: SMD/SMT; Package Size: 0201 (0603 Metric); HEIGHT: 0.35MM; ROHS: Yes; Tolerance: 10%; PCB Footprint: 0201_CC
J801 J802 = CON_2X40_A: CON 2X40 PLUG SHRD SMT 0.4MM SP 51H AU; CLASS: IO; 3D_Mechanical_Footprint_File: ftp://fcl.am.freescale.net/ALLEGRO/step/con80_0p4_17p7x2p05_sm.step; MFG_NAME01: HIROSE; CAD_APPROVED: Yes; AGILE_PN: 211-80176; PCB Footprint: con80_0p4_17p7x2p05_sm; ROHS: Yes; HEIGHT: 1.29MM
J803 = HDR_2X50_M_A: CON 2X50 PLUG SHRD SMT 0.4MM SP 51H AU; CLASS: IO; 3D_Mechanical_Footprint_File: ftp://fcl.am.freescale.net/ALLEGRO/step/con100_0p4_21p7x2p05_sm.step; MFG_NAME01: HIROSE; Temp Range: -35 to 85 &#8451;; CAD_APPROVED: Yes; AGILE_PN: 211-80305; PCB Footprint: con100_0p4_21p7x2p05_sm; MFG_PN01: DF40C-100DP-0.4V(51); ROHS: Yes; HEIGHT: 1.29MM
R801 = RES: as R704 on sheet C-10 PMIC; PCB Footprint: 0603_CC; HEIGHT: 0.6MM; ROHS: Yes
R802 = RES: RES MF ZERO OHM 1/8W -- 0805; CLASS: DISCRETE; AGILE_PN: 470-75442; FPLIST: RC0805_OV,RC0805,RC0805_OV_3P,0805_CC; Tolerance: 5%; CAD_APPROVED: Yes; Temp Range: ¨C55 ¡ãC to +155 ¡ãC; MFG_NAME01: YAGEO AMERICA; MFG_PN01: RC0805JR-070RL; PCB Footprint: RC0805_OV; HEIGHT: 0.7 MM; ROHS: Yes
TP801 TP802 = TESTLOOP: TEST POINT PAD 50MIL DIA SMT, NO PART TO ORDER; ASSY_OPT: DNP; CLASS: IO; AGILE_PN: 211-76644; MFG_NAME01: NOTACOMPONENT; CAD_APPROVED: Yes; MFG_PN01: NOTACOMPONENT; ROHS: Yes; HEIGHT: 0.1MM; PCB Footprint: TPAD_050
TP803 TP804 = TESTLOOP: TEST POINT PAD 50MIL DIA SMT, NO PART TO ORDER; ASSY_OPT: DNP; CLASS: IO; CAD_APPROVED: Yes; MFG_PN01: NOTACOMPONENT; AGILE_PN: 211-76644; HEIGHT: 0.1MM; ROHS: Yes; MFG_NAME01: NOTACOMPONENT; PCB Footprint: TPAD_050
TP805 = T POINT R: as TP603 on sheet C-09 BOOT_CFG; HEIGHT: 0.1MM; ROHS: Yes; PCB Footprint: testpoint_35mil